# EAGLE board barbi_pozoriste_master_revb (EAGLE 5.00)
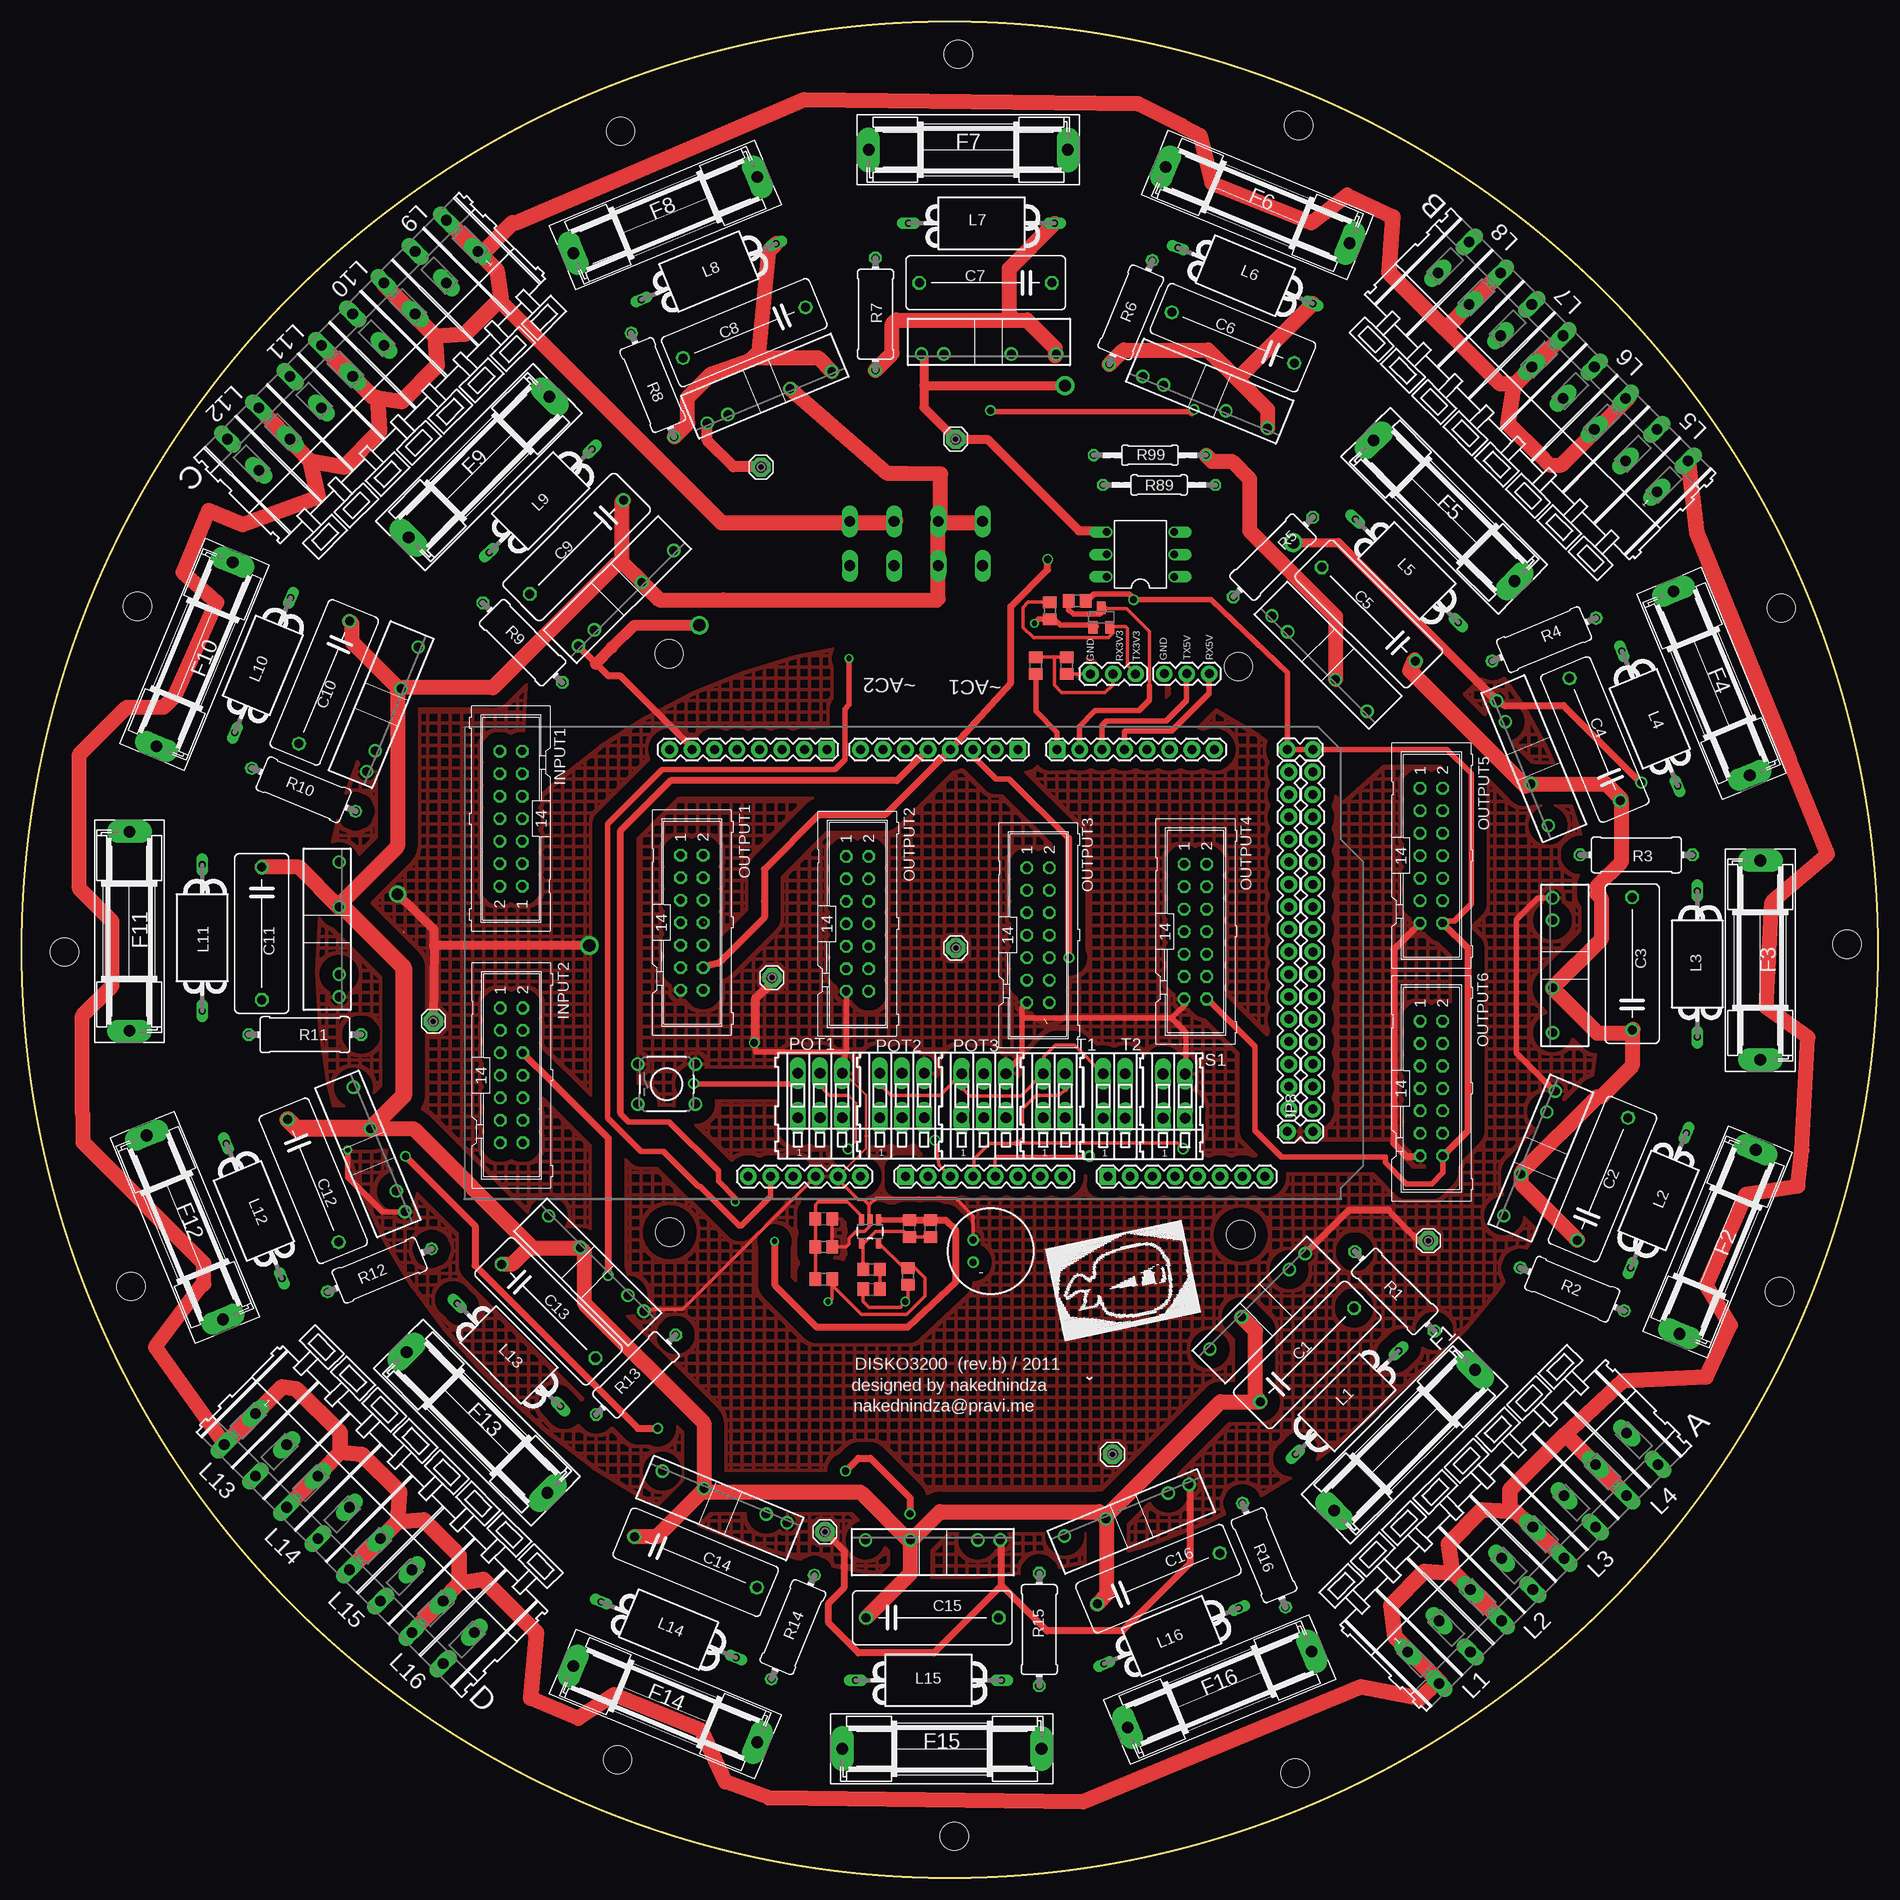
[diagram p2: board, top side]
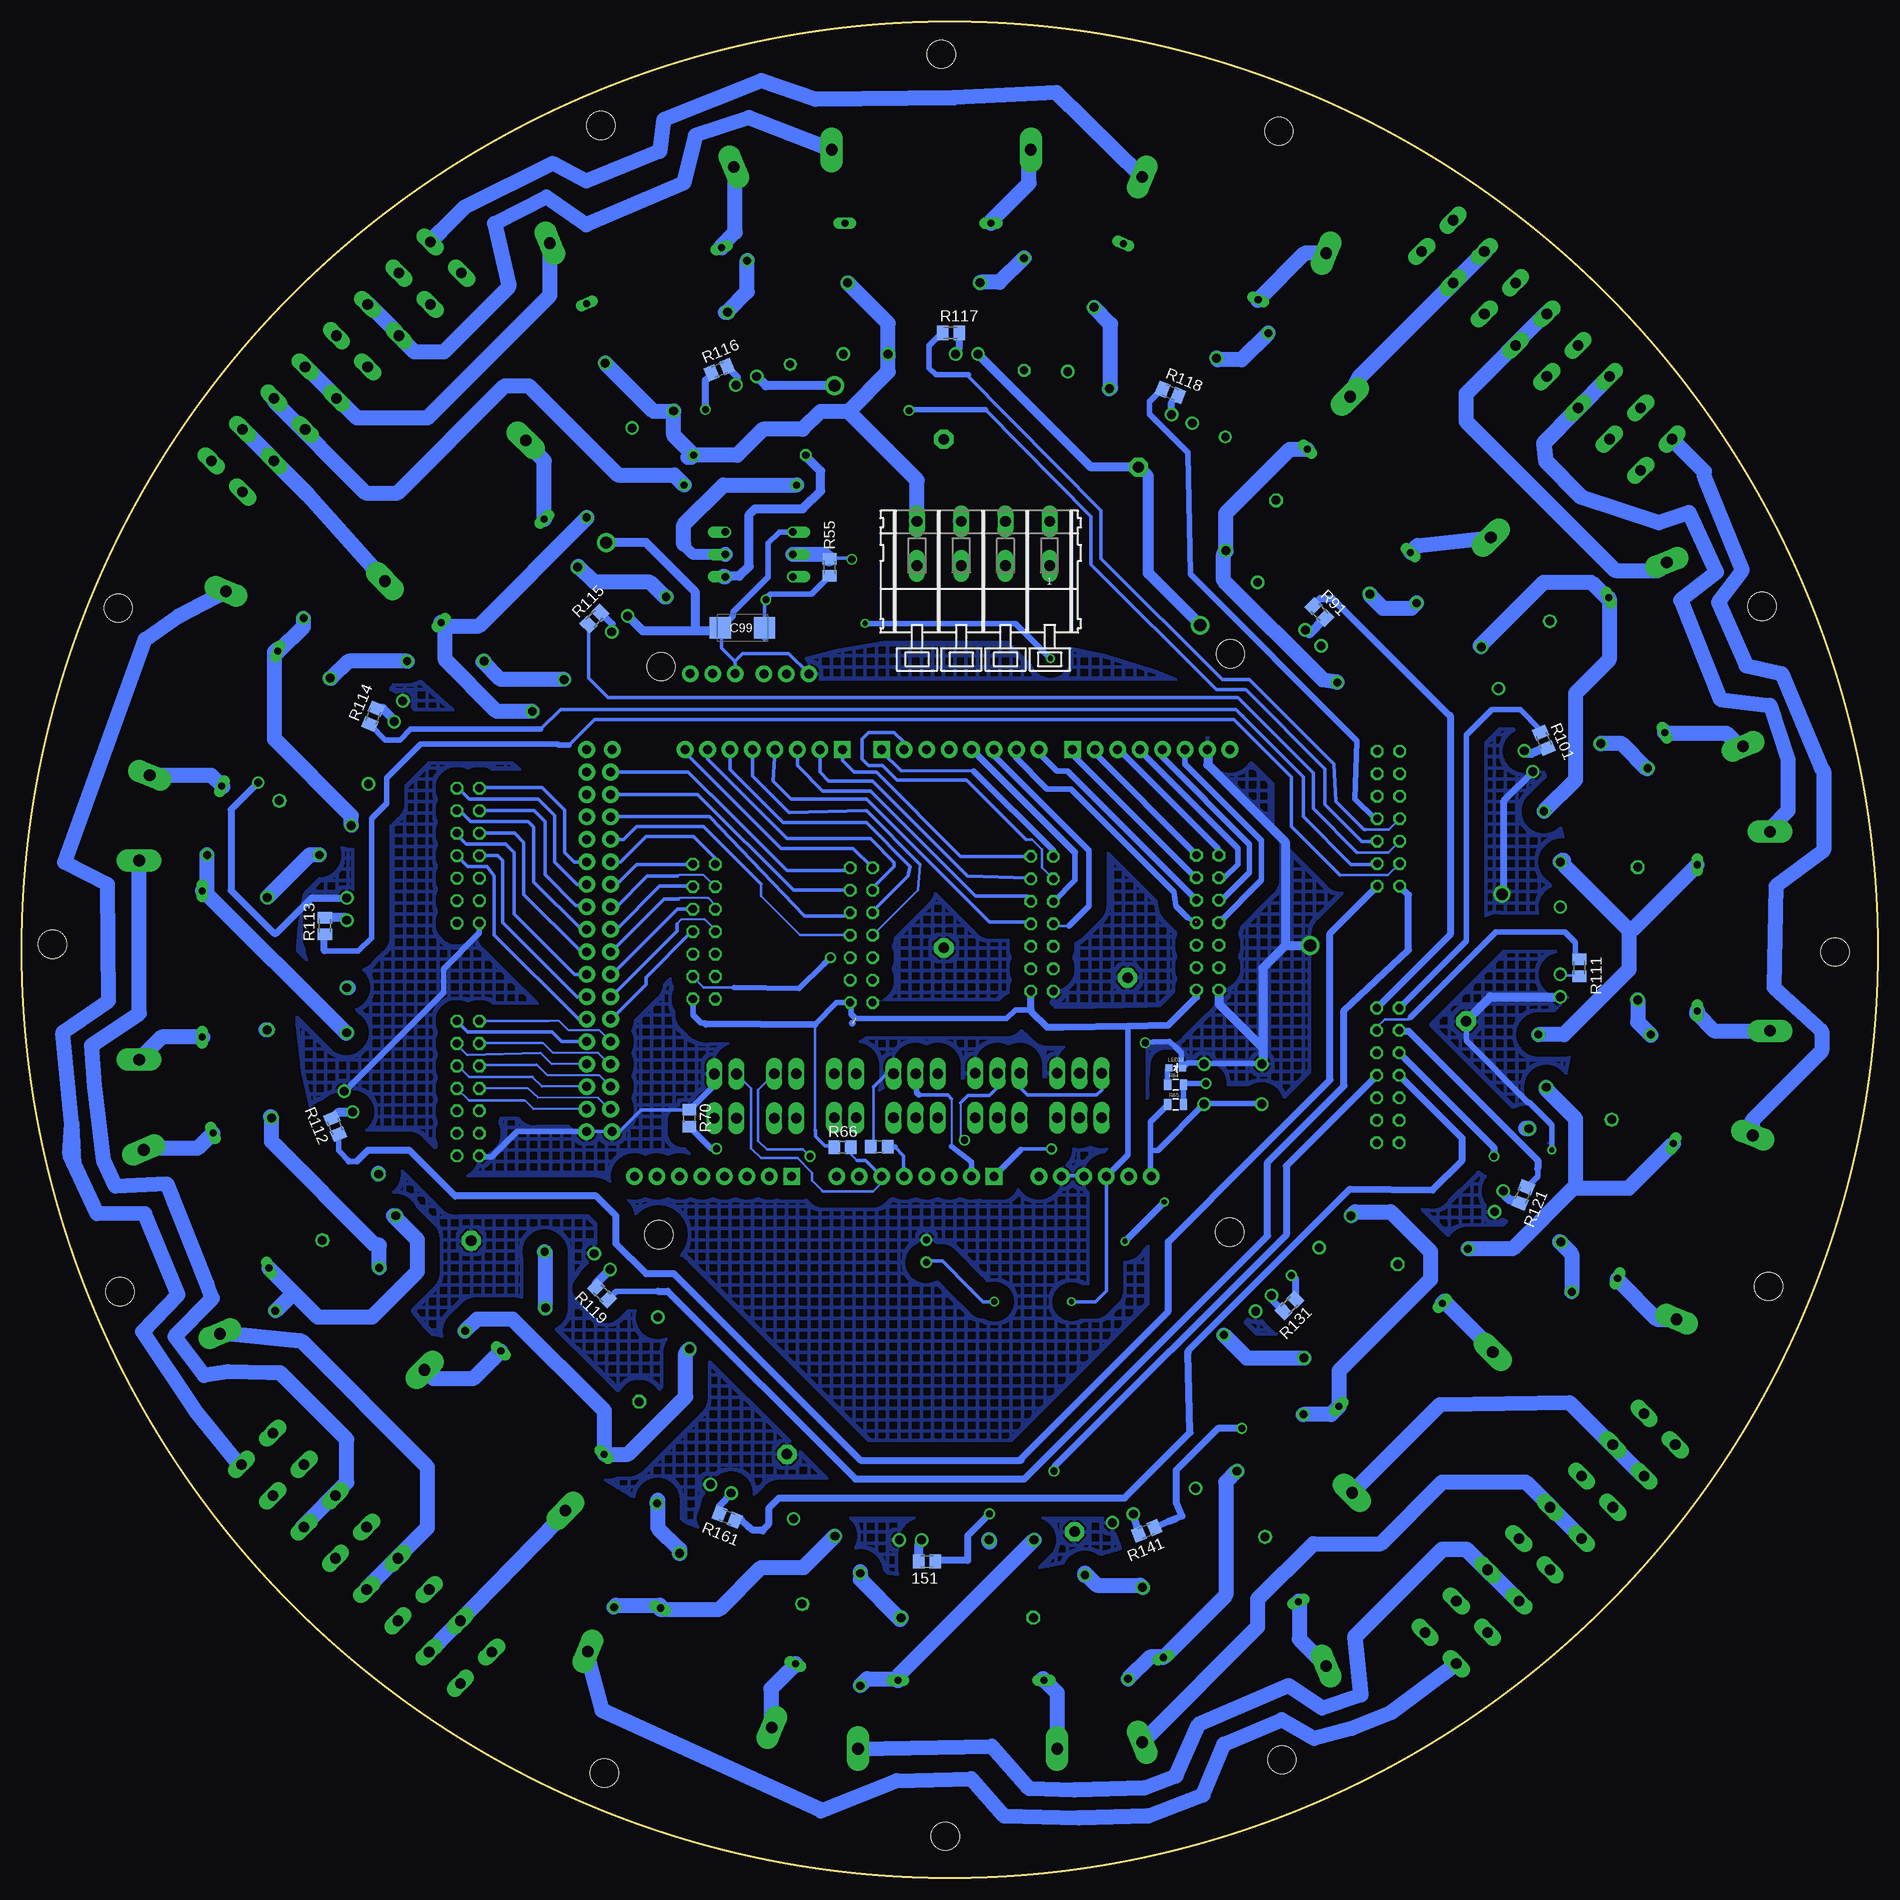
[diagram p3: board, bottom side, seen from below]

No outline drawn. Coordinates in mm, seen from the top.
Copper layers (1*16): Top 0.035mm / dielectric 1.5mm / Bottom 0.035mm
Design rules "default *": minimum track width 10mil, minimum drill 24mil, track to track 0.15mm, track to pad 0.15mm, pad to pad 0.15mm, via to via 0.15mm, smd to smd 0.15mm, copper to edge 40mil, drill to drill 8mil, minimum pad ring 10mil, minimum via ring 8mil, stop-mask expansion 4mil, vias tented up to drill 0mil, thermal gap 10mil
Holes 3.2 mm at -32.4,33.23 32.21,-32.42 -32.33,-32.15 31.94,31.79 -37.88,92.31 38.37,-93.28 -93.23,-38.28 -38.24,-91.8 38.76,92.95 93.31,38.39 -92.5,38.6 93.12,-38.88 0.27,101 -100.74,-0.47 -0.17,-100.44 100.73,0.41
Milling: area -105.5,-105.1 to 104.2,104.6

## Footprints (pad centres in the part's own frame; a part is rotated, then mirrored left to right if it is on the bottom)
M0805 = smd 1.3 x 1.6: 1 -0.95,0; 2 0.95,0
C150-064X183 = drill 1.016 octagon: 1 -7.493,0; 2 7.493,0
C0805 = smd 1.3 x 1.5: 1 -0.95,0; 2 0.95,0
SMC_C = smd 2.4 x 2.4: + -2.5,0; - 2.5,0
SH22,5 = drill 1.321 pad 2.54 long: 1 -11.252,0; 2 11.252,0
1X03 = drill 1.016 pad 1.88: 1 0,0; 2 2.54,0; 3 5.08,0
1X08 = drill 1.016 pad 1.88 square: 1 0,0 | drill 1.016 pad 1.88: 2 2.54,0; 3 5.08,0; 4 7.62,0; 5 10.16,0; 6 12.7,0; 7 15.24,0; 8 17.78,0
1X16 = drill 1.016 pad 1.88: 1 0,0; 2 2.54,0; 3 5.08,0; 4 7.62,0; 5 10.16,0; 6 12.7,0; 7 15.24,0; 8 17.78,0; 9 20.32,0; 10 22.86,0; 11 25.4,0; 12 27.94,0; 13 30.48,0; 14 33.02,0; 15 35.56,0; 16 38.1,0
1X06 = drill 1.016 pad 1.88: 1 0,0; 2 2.54,0; 3 5.08,0; 4 7.62,0; 5 10.16,0; 6 12.7,0
1X02_LOCK = drill 1.016 pad 1.88: 1 -0.178,0; 2 2.718,0
S102S01 = drill 1: 1 -7.62,0; 2 -2.54,0; 3 5.08,0; 4 7.62,0
ZD6-2W5 = drill 0.8 long: 1 -8.255,0; 2 8.255,0
LED-0603 = smd 0.8 x 0.8: A 0,-0.75; C 0,0.75
MCS08 = drill 1.194 pad 2.159 octagon: MP 0,0
DIL06 = drill 0.813 offset: 1 -2.54,-3.81; 2 0,-3.81; 3 2.54,-3.81; 4 2.54,3.81; 5 0,3.81; 6 -2.54,3.81
SOT23 = smd 1 x 1.4: 1 -0.95,-1.1; 2 0.95,-1.1; 3 0,1.1
0411/12 = drill 0.914 octagon: 1 -6.35,0; 2 6.35,0
R0805 = smd 1.3 x 1.5: 1 -0.95,0; 2 0.95,0
0805 = smd 0.8 x 1.2: 1 -0.9,0; 2 0.9,0
0207/12 = drill 0.813 octagon: 1 -6.35,0; 2 6.35,0
TACTILE-PTH = drill 1.016: 1 -3.251,2.261; 2 3.251,2.261; 3 -3.251,-2.261; 4 3.251,-2.261
ML14 = drill 0.914 octagon: 1 -7.62,-1.27; 2 -7.62,1.27; 3 -5.08,-1.27; 4 -5.08,1.27; 5 -2.54,-1.27; 6 -2.54,1.27; 7 0,-1.27; 8 0,1.27; 9 2.54,-1.27; 10 2.54,1.27; 11 5.08,-1.27; 12 5.08,1.27; 13 7.62,-1.27; 14 7.62,1.27
MIC-9.7MM = drill 0.8: 1 -2,1.27; 2 -2,-1.27
SOT23-5 = smd 0.55 x 1.2: 1 -0.95,-1.3; 2 0,-1.3; 3 0.95,-1.3; 4 0.95,1.3; 5 -0.95,1.3
255-404-5 = drill 1.2 long: A1 -7.5,0; A2 -2.5,0; A3 2.5,0; A4 7.5,0; B1 -7.5,-5; B2 -2.5,-5; B3 2.5,-5; B4 7.5,-5
255-408-5 = drill 1.2 long: A1 -17.5,0; A2 -12.5,0; A3 -7.5,0; A4 -2.5,0; A5 2.5,0; A6 7.5,0; A7 12.5,0; A8 17.5,0; B1 -17.5,-5; B2 -12.5,-5; B3 -7.5,-5; B4 -2.5,-5; B5 2.5,-5; B6 7.5,-5; B7 12.5,-5; B8 17.5,-5
233-103 = drill 1.2 long: A1 -2.5,2.5; A2 0,2.5; A3 2.5,2.5; B1 -2.5,-2.5; B2 0,-2.5; B3 2.5,-2.5
233-102 = drill 1.2 long: A1 -1.25,2.5; A2 1.25,2.5; B1 -1.25,-2.5; B2 1.25,-2.5

## Placement (x,y rotation side)
151  330R  [M0805]  1.88,-69.37 180 bottom
C1  68nF  [C150-064X183]  39.73,-46.02 45 top
C2  68nF  [C150-064X183]  73.11,-26.14 67.5 top
C3  68nF  [C150-064X183]  76.46,-1.79 90 top
C4  68nF  [C150-064X183]  72.24,23.54 112.5 top
C5  68nF  [C150-064X183]  46.68,37.73 135 top
C6  68nF  [C150-064X183]  31.33,68.96 157.5 top
C7  68nF  [C150-064X183]  3.38,75.17 180 top
C8  68nF  [C150-064X183]  -23.91,69.53 202.5 top
C9  68nF  [C150-064X183]  -42.85,45.3 225 top
C10  68nF  [C150-064X183]  -71.38,30 247.5 top
C11  68nF  [C150-064X183]  -78.45,1.61 270 top
C12  68nF  [C150-064X183]  -72.62,-26.34 292.5 top
C13  68nF  [C150-064X183]  -46.03,-41.08 315 top
C14  68nF  [C150-064X183]  -29.4,-69.45 337.5 top
C15  68nF  [C150-064X183]  -2.64,-75.73 0 top
C16  68nF  [C150-064X183]  22.92,-71.3 22.5 top
C17  4.7uF  [C0805]  -9.52,-38.58 0 top
C18  12pF  [C0805]  -5.24,-31.75 90 top
C19  1uF  [C0805]  -14.92,-30.64 180 top
C99  47uF  [SMC_C]  22.74,36.17 180 bottom
F1  3A  [SH22,5]  50.73,-55.68 225 top
F2  3A  [SH22,5]  86.12,-33.24 247.5 top
F3  3A  [SH22,5]  90.94,-1.38 90 top
F4  3A  [SH22,5]  85.45,29.88 112.5 top
F5  3A  [SH22,5]  55.21,49.4 315 top
F6  3A  [SH22,5]  34.11,83.96 337.5 top
F7  3A  [SH22,5]  1.42,90.2 0 top
F8  3A  [SH22,5]  -32.84,82.81 22.5 top
F9  3A  [SH22,5]  -53.89,54.33 45 top
F10  3A  [SH22,5]  -86.03,33.17 67.5 top
F11  3A  [SH22,5]  -93.42,1.87 90 top
F12  3A  [SH22,5]  -87.15,-31.6 112.5 top
F13  3A  [SH22,5]  -54.11,-53.65 315 top
F14  3A  [SH22,5]  -32.83,-85.5 337.5 top
F15  3A  [SH22,5]  -1.57,-90.53 0 top
F16  3A  [SH22,5]  29.84,-83.84 22.5 top
JP1  [1X03]  23.57,30.97 0 top
JP2  [1X03]  15.24,30.96 0 top
JP3  [1X08]  -14.57,22.41 180 top
JP4  [1X08]  7.02,22.41 180 top
JP5  [1X08]  11.46,22.41 0 top
JP6  [1X08]  17.18,-25.85 0 top
JP7  [1X08]  -5.68,-25.85 0 top
JP8  M16PTH  [1X16]  40.36,-18.23 90 top
JP9  M16PTH  [1X16]  37.66,-18.23 90 top
JP10  [1X06]  -23.46,-25.85 0 top
JP11  [1X02_LOCK]  37.67,-20.77 0 top
JP12  [1X02_LOCK]  37.65,22.41 0 top
K1  S202S01  [S102S01]  34.12,-39.96 45 top
K2  S202S01  [S102S01]  64.87,-23.25 67.5 top
K3  S202S01  [S102S01]  67.48,-1.98 90 top
K4  S202S01  [S102S01]  64.06,20.87 112.5 top
K5  S202S01  [S102S01]  41.12,32.11 135 top
K6  S202S01  [S102S01]  28.19,61.66 157.5 top
K7  S202S01  [S102S01]  3.74,67.11 180 top
K8  S202S01  [S102S01]  -21.06,62.22 202.5 top
K9  S202S01  [S102S01]  -37.27,39.52 225 top
K10  S202S01  [S102S01]  -63.68,26.96 247.5 top
K11  S202S01  [S102S01]  -69.69,2.08 270 top
K12  S202S01  [S102S01]  -65.18,-22.79 292.5 top
K13  S202S01  [S102S01]  -40.64,-35.69 315 top
K14  S202S01  [S102S01]  -26.12,-62.07 337.5 top
K15  S202S01  [S102S01]  -2.58,-66.94 0 top
K16  S202S01  [S102S01]  19.33,-63.58 22.5 top
L1  300uH  [ZD6-2W5]  44.22,-51.41 45 top
L2  300uH  [ZD6-2W5]  79.44,-28.56 67.5 top
L3  300uH  [ZD6-2W5]  83.81,-1.83 270 top
L4  300uH  [ZD6-2W5]  78.45,25.89 292.5 top
L5  300uH  [ZD6-2W5]  50.99,42.6 135 top
L6  300uH  [ZD6-2W5]  32.73,75.97 157.5 top
L7  300uH  [ZD6-2W5]  2.91,81.89 180 top
L8  300uH  [ZD6-2W5]  -27.92,76.44 202.5 top
L9  300uH  [ZD6-2W5]  -46.93,50.52 225 top
L10  300uH  [ZD6-2W5]  -78.33,31.94 247.5 top
L11  300uH  [ZD6-2W5]  -85.17,1.12 270 top
L12  300uH  [ZD6-2W5]  -79.33,-29.75 292.5 top
L13  300uH  [ZD6-2W5]  -50.52,-46.02 135 top
L14  300uH  [ZD6-2W5]  -32.45,-77.07 157.5 top
L15  300uH  [ZD6-2W5]  -3.07,-82.8 180 top
L16  300uH  [ZD6-2W5]  24.39,-77.79 202.5 top
LED33  Red  [LED-0603]  -26.21,-13.58 270 bottom
LSP1  MCS08  [MCS08]  -20.79,-3.38 315 top
LSP2  MCS08  [MCS08]  -14.8,-66 315 top
LSP3  MCS08  [MCS08]  53.43,-33.11 315 top
LSP4  MCS08  [MCS08]  0,-0.01 315 top
LSP5  MCS08  [MCS08]  -0.01,57.48 315 top
LSP6  MCS08  [MCS08]  -22.01,54.33 315 top
LSP7  MCS08  [MCS08]  -59.05,-8.3 315 top
LSP8  MCS08  [MCS08]  17.73,-57.25 315 top
OK1  H11A1M  [DIL06]  20.87,44.47 90 top
Q1  BSS123  [SOT23]  16.45,37.34 0 top
R1  120R 2W  [0411/12]  49.61,-38.84 135 top
R2  120R 2W  [0411/12]  69.68,-38.6 337.5 top
R3  120R 2W  [0411/12]  76.92,10.5 0 top
R4  120R 2W  [0411/12]  66.5,34.84 22.5 top
R5  120R 2W  [0411/12]  35.86,44.16 45 top
R6  120R 2W  [0411/12]  19.79,71.82 247.5 top
R7  120R 2W  [0411/12]  -9.08,71.62 270 top
R8  120R 2W  [0411/12]  -34.25,63.61 292.5 top
R9  120R 2W  [0411/12]  -48.96,34.49 135 top
R10  120R 2W  [0411/12]  -73.71,17.86 337.5 top
R11  120R 2W  [0411/12]  -73.57,-9.82 0 top
R12  120R 2W  [0411/12]  -65.13,-36.46 22.5 top
R13  120R 2W  [0411/12]  -36.15,-48.27 225 top
R14  120R 2W  [0411/12]  -18.41,-76.78 247.5 top
R15  120R 2W  [0411/12]  9.44,-77.06 270 top
R16  120R 2W  [0411/12]  34.84,-68.66 292.5 top
R17  2k2  [R0805]  -5.4,-37.15 90 top
R18  10k  [R0805]  9.05,31.91 90 top
R19  10k  [R0805]  12.54,31.91 270 top
R20  10k  [R0805]  -9.53,-36.35 0 top
R21  10k  [R0805]  -14.92,-37.46 0 top
R22  10k  [R0805]  -14.92,-33.81 180 top
R23  1M  [R0805]  -2.86,-31.75 270 top
R24  10k  [R0805]  10.64,38.1 90 top
R25  10k  [R0805]  13.72,39.21 180 top
R55  10k  [M0805]  12.92,43.01 270 bottom
R64  330  [0805]  -26.21,-15.49 0 bottom
R65  10k  [0805]  -26.21,-17.71 0 bottom
R66  1k  [R0805]  11.44,-22.53 0 bottom
R70  10k  [R0805]  28.76,-19.28 270 bottom
R71  10k  [R0805]  7.28,-22.49 0 bottom
R89  47k 1W  [0207/12]  22.99,52.31 0 top
R91  330R  [M0805]  -42.44,37.94 315 bottom
R99  47k 1W  [0207/12]  21.94,55.68 0 top
R101  330R  [M0805]  -67.82,23.44 292.5 bottom
R111  330R  [M0805]  -71.85,-2.24 270 bottom
R112  330R  [M0805]  68.78,-20.18 112.5 bottom
R113  330R  [M0805]  69.95,2.47 90 bottom
R114  330R  [M0805]  64.5,26.17 67.5 bottom
R115  330R  [M0805]  39.49,37.19 45 bottom
R116  330R  [M0805]  25.36,65.33 22.5 bottom
R117  330R  [M0805]  -0.81,69.51 0 bottom
R118  330R  [M0805]  -25.61,62.78 337.5 bottom
R119  330R  [M0805]  38.61,-39.06 135 bottom
R121  330R  [M0805]  -65.49,-27.94 247.5 bottom
R131  330R  [M0805]  -39.07,-40.41 225 bottom
R141  330R  [M0805]  -22.92,-65.92 202.5 bottom
R161  330R  [M0805]  24.48,-64.35 157.5 bottom
S1  [TACTILE-PTH]  -32.69,-15.41 0 top
SV1  [ML14]  -50.28,14.6 90 top
SV2  [ML14]  -29.83,2.84 270 top
SV3  [ML14]  -11.11,2.7 270 top
SV4  [ML14]  9.32,1.43 270 top
SV5  [ML14]  27.09,1.83 270 top
SV6  [ML14]  53.77,-15.9 270 top
SV7  [ML14]  53.76,10.41 270 top
SV8  [ML14]  -50.22,-14.42 270 top
U$1  MIC9.7MM  [MIC-9.7MM]  3.97,-34.29 0 top
U$2  OPA344  [SOT23-5]  -9.68,-32.07 180 top
X1  WAGO4-255-404-5  [255-404-5]  -4.48,43.19 180 bottom
X2  WAGO8-255-408-5  [255-408-5]  -66.4,66.33 225 top
X3  WAGO8-255-408-5  [255-408-5]  -66.78,-65.01 315 top
X5  WAGO8-255-408-5  [255-408-5]  63.47,-67.24 45 top
X6  WAGO8-255-408-5  [255-408-5]  66.88,63.89 135 top
X10  [233-103]  -15.35,-16.69 0 top
X11  [233-103]  3.17,-16.72 0 top
X12  [233-103]  -6.08,-16.7 0 top
X13  [233-102]  11.14,-16.72 0 top
X14  [233-102]  17.91,-16.75 0 top
X15  [233-102]  24.67,-16.76 0 top

## Tracks (layer width: path | path; a pad name or v marks a point on that pad's centre or on a via)
3.3  (via drill 0.6)
  Top 0.61: v8.89,36.67 9.37,37.15 10.48,37.15 11.11,37.15 11.81,36.45 15.62,36.45 15.83,36.24 Q1.1 15.88,36.32 | v-12.06,32.7 -12.06,27.46 -12.54,26.99 -12.54,21.27 -13.65,20.16 -33.18,20.16 -39.37,13.97 -39.37,-19.21 -35.56,-23.02 -33.02,-23.02 -29.05,-26.99 -28.89,-26.99 -24.45,-31.43 -24.29,-31.43 -20.95,-28.1 -20.95,-26.04 -20.92,-26 JP10.2
  Top 0.813: 10.48,37.15 R24.1
  Bottom 0.61: v8.89,36.67 -8.1,36.67 v-12.06,32.7
5V  (via drill 0.8 pad 1.27)
  Top 0.406: X11.A1 -1.8,-16.69 -7.33,-16.69 -8.58,-15.44 | 0.7,-15.83 1.59,-16.72 7.39,-16.72 X13.A1 9.96,-14.15 9.96,-12.31 11.28,-10.99 13.41,-10.99 X14.A1
  Top 0.61: X12.A1 -8.58,-15.44 | X11.A1 0.7,-14.25 0.7,-15.83 | v-29.63,-15.34 -29.57,-15.41 -17.97,-15.41 -17.77,-15.21 -17.77,-14.12 | -17.77,-14.12 -17.77,-14.09 | X10.A1 -17.77,-14.12
  Bottom 0.406: R65.2 -27.17,-17.71 | R64.2 -27.17,-15.54 | -17.86,-14.21 -17.86,-16.09 -17.28,-16.66 -9.49,-16.66 -8.45,-15.62
  Bottom 0.61: -27.17,-15.54 -27.37,-15.34 | -27.07,-15.34 -27.07,-15.45 R64.2 -27.08,-15.45 | R65.2 -27.07,-17.67 -27.08,-17.67 -27.08,-15.45 | -17.86,-14.21 X10.A1 | X12.A1 -8.45,-14.19 -8.45,-15.62 | -27.08,-15.45 -27.19,-15.34 v-29.63,-15.34
A0  (via drill 0.8 pad 1.27)
  Top 0.305: v-12.18,-22.75 -11.24,-21.81 -11.24,-17.56 -12.11,-16.69
  Top 0.406: -12.11,-16.69 -14.26,-16.69 -15.38,-15.57 -15.38,-14.2 X10.A2
  Bottom 0.406: JP7.1 -5.62,-25.92 | -8.74,-22.79 -8.79,-22.75 v-12.18,-22.75
  Bottom 0.61: -8.74,-22.79 JP7.1
A1
  Bottom 0.254: -0.89,-17.06 -0.89,-22.47
  Bottom 0.406: 2.78,-16.66 -0.45,-16.63 -0.89,-17.06
  Bottom 0.61: X11.A2 3.08,-14.31 3.08,-16.36 2.78,-16.66 | JP7.2 -3.15,-24.23 -0.89,-22.47
A2  (via drill 0.8 pad 1.02)
  Top 0.406: JP7.3 -1.89,-24.57 v-2.34,-21.75
  Bottom 0.254: v-2.34,-21.75 -1.89,-21.3 -1.89,-17.57
  Bottom 0.406: -1.89,-17.57 -2.77,-16.69 -5.18,-16.69 -6.14,-15.73 -6.14,-14.14 X12.A2
  Bottom 0.61: -6.01,-14.19 -6.07,-14.19 X12.A2
A3  (via drill 0.8 pad 1.27)
  Top 0.305: 7.62,-18.17 7.62,-21.38 6.93,-22.06 | 25.03,-22.04 v25.7,-22.71
  Top 0.406: 12.38,-16.02 11.69,-16.71 9.09,-16.71 7.62,-18.17 | 6.87,-22.13 3.8,-22.13 2.09,-23.84 2.09,-25.81 | 6.91,-22.04 25.03,-22.04
  Top 0.61: X13.A2 12.38,-14.23 12.38,-16.02 | 6.87,-22.13 6.93,-22.06 6.91,-22.04 | 2.09,-25.81 1.98,-25.81 JP7.4
  Bottom 0.61: R70.2 26.28,-22.71 v25.7,-22.71
A4  (via drill 0.8 pad 1.27)
  Top 0.305: v15.12,-23.57 | 4.44,-25.83 4.46,-25.83 JP7.5 | 4.7,-23.57 4.44,-23.82
  Top 0.406: v15.12,-23.57 4.7,-23.57 | 4.44,-23.82 4.44,-25.83
  Bottom 0.305: X14.A2 21,-16.09 21,-21.81 19.99,-22.82 15.92,-22.82 15.17,-23.57 v15.12,-23.57
  Bottom 0.406: 4.54,-25.8 4.54,-23.5 5.52,-22.52
  Bottom 0.61: JP7.5 4.54,-25.8 | 6.36,-22.52 6.39,-22.52 | 6.36,-22.52 R71.2 | 5.52,-22.52 6.36,-22.52
A5
  Bottom 0.305: X15.A1 21.77,-15.92 21.77,-22.67 20.66,-23.78 16.55,-23.78 14.89,-25.44 14.89,-26.31 13.77,-27.44 13.77,-27.45 13.7,-27.52 8,-27.52 6.87,-26.43 | 10.45,-22.49 10.45,-22.44 | 10.45,-22.49 R66.2 | 9.79,-24.05 10.45,-23.39 10.45,-22.49
  Bottom 0.406: JP7.6 8.82,-24.05 9.79,-24.05
  Bottom 0.61: JP7.6 7,-25.87 6.87,-25.87 6.87,-26.43
AC_NEUTRAL
  Top 1.676: -51.42,73.42 -51.42,72.97 -26.5,48.05 -11.95,48.05 | -11.95,48.05 -11.95,48.16 X1.B1 | X1.B2 -7.12,48.05 -11.95,48.05 | 63.08,63.54 62.86,63.76 61.51,63.76 55.34,69.94 55.34,70.16 55.22,70.05 | 84.86,-48.49 87.55,-42.65 84.86,-38.16 89.35,-27.84 95.19,-26.94 95.64,-22.9 96.31,-10.1 91.59,-6.73 92.27,5.17 98.55,10.55 94.29,21.11 | 20.58,95.39 25.59,92.95 27.61,91.83 28.96,86.44 40.18,81.95 44.22,85.09 49.39,82.62 | -84.42,49.39 -87.34,42.43 -83.52,39.07 -88.24,28.52 -89.54,27.21 -93.71,27.21 -99.07,21.85 -99.07,6.7 -95.35,2.98 -95.35,-4.3 -98.71,-7.66 -98.71,-18.81 -98.64,-18.88 -98.64,-22.02 -85,-35.67 -85,-38.04 -85.32,-38.16 -90.48,-45.12 -82.62,-56.12 | -48.05,-84.86 -42.66,-87.11 -38.62,-84.41 -28.74,-88.45 -26.05,-94.29 -21.11,-96.09 | 66,55.68 67.12,54.56 68.47,54.56 76.1,62.19 75.79,62.19 X6.B3
  Top 1.778: -84.42,49.39 -80.6,47.82 -72.07,50.97 -72.97,55.01 | -53.66,78.35 -51.87,76.56 -51.42,73.42 -55.46,69.38 -58.83,69.15 | -53.66,78.35 X2.B1 | X2.B3 -64.66,74.99 -58.83,69.15 | X2.B5 -65.78,62.19 -65.34,62.13 | -65.34,62.13 -62.64,61.74 -58.6,65.78 -58.83,69.15 | -72.97,55.01 X2.B7 | -72.97,55.01 -69.15,54.33 -65.11,58.37 -65.34,62.19 -65.34,62.13 | -82.85,-55.9 X3.B1 -82.62,-56.12 -76.11,-49.61 -74.54,-49.84 -69.6,-54.78 -69.6,-57.02 | -69.6,-57.02 X3.B3 | -63.09,-64.88 X3.B5 | -63.09,-64.88 -62.87,-61.51 -67.13,-57.25 -69.6,-57.02 | -56.13,-71.84 X3.B7 | -56.13,-71.84 -56.13,-68.7 -60.17,-64.66 -63.09,-64.88 | -56.13,-71.84 -53.44,-71.39 -47.38,-77.45 -48.05,-84.86 | -21.11,-96.09 14.36,-96.53 45.79,-83.51 52.53,-84.86 54.33,-83.06 X5.B1 54.77,-83.06 49.61,-77.9 49.16,-74.31 52.98,-70.49 56.11,-70.7 | X5.B3 56.35,-70.72 56.11,-70.7 | X5.B5 63.31,-63.76 62.62,-63.72 | 62.62,-63.72 59.49,-63.53 55.67,-67.35 56.12,-70.49 56.11,-70.7 | X5.B7 70.49,-56.57 68.92,-55 | 68.92,-55 62.63,-61.29 62.63,-63.53 62.62,-63.72 | X6.B5 63.08,63.54 62.41,59.27 66,55.68 | X1.B2 -6.78,48.27 | X1.B1 -12.17,47.82 | X6.B1 83.74,46.92 94.29,21.11 | 84.86,-48.49 75.43,-48.94 68.92,-55 | X6.B7 55.34,69.94 55.22,70.05 48.94,76.33 49.39,82.62 | 20.58,95.39 -17.14,95.84 -49.62,81.95 -50.07,81.95 -53.66,78.35
  Bottom 1.676: R89.2 30.46,53.44 36.81,53.44 46.92,63.54 49.61,63.54 61.73,51.41 65.33,51.41 75.65,61.74 75.65,62.19 | 75.65,62.19 | X6.B3 75.65,62.19
AC_PHASE
  Top 1.676: K5.2 42.91,37.46 33.22,47.15 33.22,52.99 31.2,55.01 28.96,55.01 R99.2 | R99.2 | R99.2 | K16.2 16.99,-64.28 29.94,-51.32 C1.1 33.9,-50.78 33.9,-43.33 K1.2 | -48.05,-33.67 -47.83,-33.9 K13.2 -41.99,-34.35 -41.99,-40.18 -28.46,-53.71 K14.2 -28.46,-61.24 | -48.05,-33.67 -61.3,-20.43 -65.78,-20.43 -66.01,-20.2 -66.16,-20.35 K12.2 | C14.1 -33.81,-66.58 -28.46,-61.24 | C13.1 -50.16,-35.78 -48.05,-33.67 | 51.31,31.31 51.86,32.56 | C5.1 51.31,31.31 | 51.31,31.31 64.36,18.26 K4.2 73.53,18.52 75.2,16.84 75.11,16.74 C4.1 75.2,16.52 75.2,9.66 72.51,6.96 72.51,6.06 72.96,5.62 72.96,0.96 K3.2 67.48,-4.62 72.51,-9.65 76.1,-9.65 C3.1 | C3.1 76.55,-9.2 | C3.1 76.46,-13.34 72.96,-16.84 72.51,-16.84 63.89,-25.45 K2.2 63.89,-26.63 70.27,-33 70.24,-33.02 C2.1 | -28.46,-61.24 -28.19,-61.51 -10.78,-61.51 -5.17,-67.12 | -5.17,-67.12 -5.17,-66.98 K15.2 -5.17,-66.89 -5.17,-66.68 -4.72,-66.68 -1.8,-63.76 16.19,-63.76 K16.2 | C15.1 -5.17,-70.77 -5.17,-67.12 | K16.2 17.06,-64.63 17.06,-73.11 C16.1 | C10.1 -68.25,36.66 -68.25,34.58 -62.87,29.19 | -62.87,29.19 -62.82,29.19 K10.2 -62.6,29.41 -52.31,29.41 -38.4,43.33 -37.5,43.33 | -62.87,29.19 -63.09,28.96 -63.09,11.45 -69.6,4.94 -69.6,4.52 | -69.6,4.52 -69.6,4.49 | -69.6,4.52 K11.2 -69.73,4.62 -74.22,9.11 C11.1 | C9.1 -37.72,50.42 -37.72,43.56 -37.5,43.33 | -37.5,43.33 K9.2 -35.57,41.4 | K8.2 -7.7,53.61 -5.58,53.61 -1.7,53.55 -1.7,48.3 -1.91,48.1 -1.98,48.17 X1.B3 | X1.B3 -1.77,48.41 -1.7,48.41 -1.34,48.04 3.07,48.04 3.07,48.15 X1.B4 | X1.B3 -2,48.17 -2,39.45 -2.15,39.3 -26.25,39.3 -26.27,39.31 -33.46,39.31 -35.55,41.4 -35.57,41.4 | -35.57,41.4 -35.62,41.4
  Top 1.778: K11.2 -69.38,4.72
  Top 1.93: K11.2 -69.59,4.72 -69.38,4.72 -62.42,-2.24 -62.42,-16.71 K12.2 -66.17,-20.43 -74.48,-20.43 C12.1
  Bottom 1.676: C3.1 76.64,-9.29 | K3.2 67.32,-4.52 | 10.77,60.62 13.91,60.62 15.94,58.6 20.43,58.6 23.34,55.68 R99.2 | R99.2 28.51,55.45 28.96,55.45 | R99.2 | R99.2 | K7.2 6.28,66.91 | -1.84,48.27 -1.92,48.19 X1.B3 | C5.1 52.08,32.33 50.07,30.32 K5.2 | R99.2 | R99.2 30.53,57.93 K6.2 30.53,60.62 32.78,60.62 C6.1 | K2.2 63.89,-25.45 | C7.1 6.28,70.58 K7.2 | 10.77,60.62 6.28,65.11 K7.2 | K8.2 -18.83,63.31 -18.86,63.31 -18.86,70.52 C8.1 | X1.B4 3,48.22 3,52.84 10.77,60.62
  Bottom 1.778: K12.2 -65.78,-20.43 | K15.2 -5.17,-67.12 | X1.B4 3.1,48.27 | X1.B4 | X1.B4
D2  (via drill 0.8)
  Top 0.61: 2.02,22.45 1.99,22.45 JP4.3 1.96,22.43 | 12.79,12.35 6.04,19.1 4.54,19.1 1.96,21.68 1.96,22.43 | 1.96,22.43 1.96,22.61
  Top 0.813: v12.79,-1.12 12.79,12.35
  Bottom 0.305: SV5.12 27.17,-4.52 23.73,-4.51
  Bottom 0.61: 23.73,-4.51 16.33,-4.61 13.58,-1.91 v12.79,-1.12
D3  (via drill 0.8)
  Top 0.406: -28.55,-2.18 -28.55,-2.23 SV2.12 | -21.62,5.28
  Top 0.813: -28.55,-2.18 -26.78,-1.73 -21.62,3.42 -21.62,5.28 -21.62,8.87 -15.43,15.06 -7.95,15.06 JP4.4 6.23,29.95 6.23,38.57 10.39,42.72 v10.39,43.91
  Bottom 0.406: 12.98,44.02 13.04,44.02 | 12.98,44.02 R55.1 | v10.39,43.91 10.51,44.02 12.98,44.02
  Bottom 1.676: R55.1 12.97,43.96 13.48,44.47 OK1.5
D4  (via drill 0.6)
  Top 0.406: -5.4,-30.8 -5.39,-30.8 C18.2 -5.08,-30.8 -5.11,-30.77 | -3.02,22.54 JP4.5
  Top 0.61: v-24.92,-28.73 -24.92,-28.26 -26.83,-26.35 -26.83,-25.24 -32.38,-19.68 -36.99,-19.68 -37.94,-18.73 -37.94,-18.57 | -5.11,-30.77 U$2.1
  Top 0.813: v-20.48,-33.18 -20.48,-38.1 -15.72,-42.86 -5.4,-42.86 0,-37.78 0,-31.91 -1.11,-30.8 R23.1 -5.08,-30.8 | -37.94,-18.57 -37.94,13.18 -32.23,18.89 -6.67,18.89 JP4.5 | -5.08,-30.8 -5.11,-30.77 | -5.08,-30.8 C18.2
  Bottom 0.406: -3.19,22.41 JP4.5 | -12.35,5.17 -12.38,5.2 SV3.5
  Bottom 0.61: -14.82,10.78 -14.82,7.63 -12.38,5.2
  Bottom 0.813: -14.82,10.78 -3.19,22.41 | v-24.92,-28.73 v-20.48,-33.18
D5
  Bottom 0.305: -12.38,2.89 -12.35,2.92 | -12.38,2.89 SV3.7 | -14.15,2.47 -12.8,2.47 -12.38,2.89
  Bottom 0.406: -5.68,21.71 JP4.6
  Bottom 0.61: -5.68,21.71 -16.39,11 -16.39,4.72 -14.15,2.47
D6  (1 unrouted)
  Bottom 0.305: -28.44,2.84 -28.29,2.7
  Bottom 0.61: JP4.7 -8.18,22.45 -8.09,22.45 -8.09,21.55 -11.68,17.96 -14.37,17.96 -26.05,6.29 -26.27,4.72 -27.62,3.37 -28.52,2.92 -28.52,2.89 SV2.8
D7
  Bottom 0.61: SV2.6 -13.96,19.98 -12.8,19.98 -11.01,21.78 -11.01,22.23 -10.94,22.23 JP4.8
D8
  Bottom 0.406: -28.41,7.97 -28.51,7.97 SV2.4
  Bottom 0.61: JP3.1 -14.82,22.16 -14.82,21.55 -28.29,8.08 -28.72,8.08 | -28.72,8.08 -28.74,8.08 | -28.72,8.08 SV2.4
D9
  Bottom 0.305: -28.56,10.51 SV2.2
  Bottom 0.61: -16.84,22.23 -28.56,10.51
  Bottom 0.813: JP3.2 -17.07,22.45 -16.84,22.23
D10
  Bottom 0.305: JP3.3 -19.81,22.41
  Bottom 0.406: -31.12,10.46 SV2.1 -30.99,10.35 | -30.99,10.35 -30.99,10.33 | -30.99,11.23 -30.99,10.35
  Bottom 0.61: -31.12,10.46 -31.21,10.55 | -19.81,22.41 -30.99,11.23
D11
  Bottom 0.305: JP3.4 -22.19,22.27
  Bottom 0.406: SV2.3 -31.15,7.92 -31.21,7.86 -31.66,7.86
  Bottom 0.61: -22.19,22.27 -33.23,11.23 -33.23,9.43 -31.66,7.86
D12
  Bottom 0.305: JP3.5 -24.73,22.42 -24.7,22.45 -24.7,21.55
  Bottom 0.406: -31.43,5.38 SV2.5
  Bottom 0.61: -24.7,21.55 -34.58,11.68 -34.58,8.53 -31.43,5.38
D13
  Bottom 0.305: -31.1,2.81 -30.99,2.7 | -31.1,2.81 SV2.7 | -31.1,2.81 -31.21,2.92 -31.44,3.15
  Bottom 0.406: -31.21,2.92 -31.13,2.84 SV2.7
  Bottom 0.61: -31.21,2.92 -35.93,7.63 -35.93,12.13 -27.27,20.78 JP3.6 -27.17,22.51
D14
  Top 0.61: R18.1 9.05,26.73 11.45,24.33 11.45,22.6 11.48,22.58 11.46,22.56 JP5.1
  Top 0.813: JP5.1 11.43,22.38 | JP5.1 | JP5.1 11.59,22.54
  Bottom 0.406: JP5.1 11.46,21.15 10.16,19.84 7.62,19.84 -1.91,10.32 -9.68,10.32 -9.84,10.16 -9.85,10.16 SV3.2
D15
  Top 0.406: 21.91,29.65 21.9,35.75 21.9,35.76 19.3,38.35 16.89,38.35 16.81,38.44 | 16.81,38.44 16.76,38.48 | 16.81,38.44 Q1.3
  Top 0.61: 21.91,29.65 21.91,28 20.7,26.8 15.75,26.8 13.97,25.02 13.97,22.48 14,22.45 JP5.2 | R25.2 12.77,38.16 13.34,37.72 16.26,37.72 16.89,38.35 16.83,38.42 Q1.3
  Bottom 0.305: -9.85,7.67 -9.88,7.63 | SV3.4 -9.85,7.67 | -9.85,7.67 -9.66,7.86
  Bottom 0.406: JP5.2 14,19.85 13.02,18.86 8.08,18.86 -2.7,8.08 -9.66,7.86
D16
  Top 0.61: JP1.2 26.06,29.6 26.06,27.97 23.75,25.65 17.02,25.65 16.51,25.15 16.51,22.23 16.54,22.26 JP5.3
  Bottom 0.305: -10.03,5.24 -10.11,5.17 | SV3.6 -10.03,5.24 | -10.03,5.24 -9.43,5.84
  Bottom 0.406: JP5.3 16.54,20.59 13.69,17.74 8.3,17.74 -3.6,5.84 -9.43,5.84
D17
  Top 0.61: JP1.3 28.6,29.89 28.6,28.73 24.38,24.51 19.18,24.51 19.05,24.38 19.05,22.7 19.21,22.54 JP5.4
  Bottom 0.305: -9.66,2.92 -9.4,2.73 SV3.8
  Bottom 0.406: JP5.4 19.31,18.87 17.26,16.82 8.77,16.82 8.75,16.84 -5.17,2.92 -9.66,2.92
D18
  Bottom 0.305: 8.04,1.38 8.08,1.35 | SV4.7 8.04,1.38 | 2.69,9.43 2.91,6.51 8.04,1.38
  Bottom 0.406: JP5.5 21.62,19.39 17.51,15.27 8.75,15.49 2.69,9.43
D19
  Bottom 0.305: SV4.5 8.04,4.08
  Bottom 0.406: JP5.6 24.16,20.13 18.18,14.15 8.75,14.15 3.81,9.21 4.04,8.08 8.04,4.08
D22
  Bottom 0.305: 10.59,9.17 10.55,9.21 | SV4.2 10.59,9.17 | 10.59,9.17 11,8.76
  Bottom 0.406: 11,8.76 17.73,8.76 26.3,17.33 26.38,17.33 28.89,19.84 37.47,19.84 37.62,20 37.66,19.97 JP9.16
D24
  Bottom 0.406: JP9.15 27.8,17.33 16.99,6.51 10.48,6.51 10.47,6.51 | 10.47,6.51 10.32,6.35 | SV4.4 10.47,6.51
D26
  Bottom 0.305: 10.59,4.23 10.55,4.27 | SV4.6 10.59,4.23 | 10.59,4.23 11.22,3.59
  Bottom 0.406: 11.22,3.59 15.71,3.59 26.49,14.82 37.52,14.82 37.62,14.92 37.66,14.89 JP9.14
D28
  Bottom 0.305: SV4.8 16.24,1.43 20.65,5.84 20.65,7.19
  Bottom 0.406: 20.65,7.19 27.16,13.7 34.72,13.7 36.2,12.22 37.62,12.22 37.65,12.25 JP9.13
D30
  Bottom 0.305: SV5.1 25.82,9.21
  Bottom 0.406: 25.82,9.21 25.81,9.22 25.81,10.11 28.28,12.57 33.62,12.57 36.51,9.68 37.69,9.68 | 37.69,9.68 JP9.12 | 37.69,9.68 37.72,9.65
D31
  Bottom 0.406: JP8.12 41.77,9.71 42.86,10.79 42.86,15.56 45.4,18.1 52.23,18.1 52.39,17.94 SV7.1
D32
  Bottom 0.406: 28.34,9.43 28.28,9.43 | SV5.2 28.34,9.43 | 28.34,9.43 34.7,9.43 36.99,7.14 37.62,7.14 37.65,7.17 JP9.11
D33
  Bottom 0.406: SV7.2 54.86,18.03 53.66,16.83 45.88,16.83 43.97,14.92 43.97,9.68 41.43,7.14 40.32,7.14 40.34,7.17 JP8.11
D34
  Bottom 0.254: 30.08,8.08 29.95,8.21 27.13,8.21 25.92,7 25.79,7 25.79,6.94 SV5.3
  Bottom 0.305: SV5.3 25.82,6.97
  Bottom 0.406: 30.08,8.08 33.51,8.08 36.99,4.6 37.62,4.6 37.65,4.63 JP9.10
D35
  Bottom 0.406: SV7.3 46.29,15.49 45.09,14.29 45.09,8.26 41.59,4.76 40.64,4.76 40.36,4.48 | 40.36,4.48 40.32,4.45 | JP8.10 40.36,4.48
D36
  Bottom 0.406: SV5.4 28.37,6.92 28.37,6.96 32.09,6.96 36.99,2.06 37.62,2.06 37.65,2.09 JP9.9
D37
  Bottom 0.406: SV7.4 54.7,15.49 53.5,14.29 46.99,14.29 46.35,13.65 46.35,7.46 40.96,2.06 40.32,2.06 40.34,2.09 JP8.9
D38
  Bottom 0.254: 30,5.53 29.91,5.62 26.6,5.62 25.89,4.91 25.89,4.35 25.84,4.35 SV5.5
  Bottom 0.305: SV5.5 25.92,4.37
  Bottom 0.406: 30,5.53 31.62,5.53 37.62,-0.48 37.65,-0.45 JP9.8
D39
  Bottom 0.406: SV7.5 48.51,12.95 47.47,11.91 47.47,6.03 40.96,-0.48 40.48,-0.48 40.36,-0.6 | 40.36,-0.6 40.32,-0.64 | JP8.8 40.36,-0.6
D40
  Bottom 0.406: JP9.7 37.49,-2.99 37.47,-3.02 30.08,4.37 SV5.6
D41
  Bottom 0.406: SV7.6 55.03,12.8 53.98,11.75 49.53,11.75 48.58,10.79 48.58,3.81 41.75,-3.02 40.32,-3.02 | 40.32,-3.02 40.35,-2.99 JP8.7 | 40.32,-3.02 40.16,-3.17
D42
  Bottom 0.254: SV5.7 25.82,2.01 26.99,3.17 29.69,3.17 30.16,2.7
  Bottom 0.305: SV5.7 25.82,2.03
  Bottom 0.406: JP9.6 37.65,-5.53 37.62,-5.56 30.16,1.91 30.16,2.7
D43
  Bottom 0.406: SV7.7 50.42,10.41 49.85,9.84 49.85,2.86 41.43,-5.56 40.64,-5.56 40.48,-5.4 JP8.6
D44
  Bottom 0.406: SV5.8 28.49,1.83 33.66,-3.33 33.66,-4.13 37.62,-8.1 37.65,-8.07 JP9.5
D45
  Bottom 0.406: JP8.5 41.3,-8.07 50.8,1.43 50.8,8.1 51.59,9.21 53.82,9.21 55.03,10.42 | 55.03,10.42 55.09,10.48 | 55.03,10.42 SV7.8
D46
  Bottom 0.254: JP9.4 38.91,-9.34 42.4,-9.34 43.5,-8.26 44.61,-8.26 44.63,-8.28 44.7,-8.28
  Bottom 0.305: 44.7,-8.28 SV6.1
D47
  Bottom 0.406: JP8.4 43.2,-10.61 44.29,-9.53 53.82,-9.53 55.06,-8.28 | 55.06,-8.28 55.09,-8.26 | 55.06,-8.28 SV6.2
D48
  Bottom 0.254: JP9.3 37.81,-13.15 39.06,-11.87 44.14,-11.87 45.27,-10.77 45.34,-10.77
  Bottom 0.305: SV6.3 52.5,-10.81 52.53,-10.77 45.34,-10.77
D49
  Bottom 0.254: 45.57,-11.9 44.31,-13.15 JP8.3
  Bottom 0.305: SV6.4 55.04,-10.59 55.22,-10.77 53.88,-12.12 45.57,-11.9
D50
  Bottom 0.254: JP9.2 38.92,-14.41 44.8,-14.41 46.02,-13.2 | 46.02,-13.2 46.04,-13.18 | 46.02,-13.2 46.02,-13.24
  Bottom 0.305: SV6.5 52.42,-13.36 52.3,-13.24 46.02,-13.24
D51
  Bottom 0.254: 46.51,-14.59 46.51,-14.61 45.42,-15.69 JP8.2
  Bottom 0.305: SV6.6 55.04,-13.28 55,-13.24 53.65,-14.59 46.51,-14.59 46.47,-14.59
D52
  Bottom 0.254: JP9.1 37.81,-18.23 39.05,-16.97 45.88,-16.94 46.99,-15.88 52.39,-15.88 52.5,-15.98 | 52.5,-15.98 52.55,-16.03 | 52.5,-15.98 SV6.7
D53
  Bottom 0.254: 47.37,-17.29 47.33,-17.29 46.38,-18.23 JP8.1
  Bottom 0.305: 55.22,-15.71 SV6.8 53.65,-17.29 47.37,-17.29
GND  (via drill 0.6, 0.8, 0.9 pad 1.27, 1.3 pad 1.93, 1.4)
  Top 0.305: -13.14,-25.69 -10.12,-22.68 -10.12,-21.29 -10.12,-16.62 -12.73,-14.01
  Top 0.406: 7.85,-6.06 7.91,-6.06 SV4.13 | K13.4 -35.18,-41.01 -35.18,-40.88 -30.86,-40.88 JP10.4 | X10.A3 -12.82,-14.17 -12.82,-14.01 -12.73,-14.01 | -29.86,22.35 -29.86,22.23 | -29.86,22.35 JP3.7 | -29.86,22.68 -29.86,22.35 | C19.1 | C19.1 | C19.1 R22.1 -12.38,-33.81 -12.06,-33.5 -12.06,-32.86 -11.27,-32.07 -10.32,-32.07 -9.68,-31.43 -9.68,-30.96 | -9.68,-30.96 | -9.68,-30.96 U$2.2 -9.75,-30.77 -9.78,-30.73 -9.78,-29.08 | U$1.1 1.97,-30.29 0,-28.32 -9.02,-28.32 -9.78,-29.08 | JP10.5 -13.3,-26.2 -11.05,-28.45 -10.41,-28.45 -9.78,-29.08 | 15.24,30.99 | JP2.1 15.24,30.99 | R19.2 15.21,30.96 15.24,30.99 | -10.12,-21.29
  Top 0.61: v-22.78,-10.73 -22.55,-11.75 -12.54,-11.75 | -12.54,-11.75 -12.39,-11.75 -12.37,-11.72 -12.34,-11.72 -12.34,-4.96 SV3.13 | -13.14,-25.69 JP10.5 | -12.54,-11.75 | -12.54,-11.75 -12.54,-14 | 7.46,-6.78 SV4.13 7.46,-6.78 | 7.46,-6.78 7.46,-12.24 5.88,-13.82 5.88,-14.01 X11.A3 | 7.46,-6.78 7.46,-7.97 7.47,-7.96 24.4,-7.96 | 25.94,-5.67 25.94,-5.65 | 25.94,-5.67 SV5.13 | 24.4,-7.96 25.94,-6.42 25.94,-5.67 | X15.A2 26,-14.19 26,-9.55 24.4,-7.96 | K3.4 65.81,5.64 63.34,3.17 63.34,-11.91 67.64,-16.2 K2.4 | 48.94,-29.63 48.94,-29.64 48.9,-29.69 52.32,-33.11 LSP3.MP | K12.4 -64.78,-29.83 -68.74,-25.88 v-68.74,-22.86 | -59.05,0.25 -58.98,0.25
  Top 0.813: SV6.13 52.64,-23.66 | 48.94,-29.63 44.45,-29.63 K1.4 | SV7.13 49.5,-0.2 49.5,-22.11 50.96,-23.57 52.53,-23.57 | K9.4 -40.67,32.13 -39.29,30.76 -37.95,30.76 -29.86,22.68 | K15.4 5.16,-67.06 5.16,-72.06 | 5.16,-72.06 10.32,-77.23 18.85,-77.23 26.49,-69.59 26.49,-60.61 26.42,-60.61 K16.4 | LSP2.MP -12.58,-68.22 -12.58,-72.29 -14.37,-74.08 -14.37,-76.33 -11.01,-79.7 -2.48,-79.7 5.16,-72.06 | v77.48,18.69 77.4,18.69 68.69,27.39 61.96,27.39 61.28,28.07 61.14,27.92 K4.4
  Top 1.016: LSP7.MP -58.98,0.25 -58.96,2.06 v-63.09,6.06 | K4.4 43.25,45.8 v38.16,45.8 | K7.4 -3.6,66.83 -3.6,63.54 | -3.6,63.54 -3.6,61.07 -0.23,57.7 -0.23,57.25 LSP5.MP 3.59,57.48 13.91,47.15 17.06,47.15 OK1.4 | -3.6,63.54 | -3.6,63.54 v12.34,63.54 | v-41.4,0.25 -59.05,0.25 | LSP1.MP -20.79,-3.9 -22.61,-5.71 -22.61,-10.67 -22.73,-10.79 -22.78,-10.75 v-22.78,-10.73
  Top 1.27: v-29,36.47 -36.33,36.47 -38.89,33.91 -40.67,32.13 | K8.4 -28.1,57.34 -25.14,54.38 -21.97,54.38 -22.01,54.34 LSP6.MP
  Top 1.422: -40.67,32.13 | -38.89,33.91
  Bottom 0.305: 7.92,-15.75 7.92,-22.18
  Bottom 0.406: SV2.13 -31.1,-4.82 | 6.33,-14.17 7.92,-15.75 | JP10.5 -13.33,-25.83 -13.33,-25.72 -15.7,-25.72 JP10.4 | R70.1 34.21,-18.33 36.67,-20.8 37.31,-20.8 37.47,-20.64 37.49,-20.66 JP11.1 37.44,-20.77 | 37.44,-20.77 JP11.2 | 37.44,-20.77 37.31,-20.64 | 23.57,32.38 23.57,32.43 22.73,33.27 17.53,33.27 15.24,30.99 | 23.57,32.38 JP1.1 | 15.24,30.99 | 15.24,30.99 JP2.1 | 23.57,32.38 23.62,32.38 25.11,33.87 25.11,35.11
  Bottom 0.61: -36.05,-13.1 -35.99,-13.1 S1.1 -35.85,-13.06 -29.53,-13.06 S1.2 -29.31,-13.02 -27.53,-13.02 LED33.C -26.86,-13.48 -26.86,-11.87 -26.13,-11.14 -25.52,-10.62 -23.71,-10.65 v-22.78,-10.73 | -31.18,-4.63 -31.18,-4.7 SV2.13 | 7.92,-22.18 R71.1 | X11.A3 5.69,-14.2 5.69,-14.17 6.33,-14.17 | 25.98,-14.21 25.98,-14.17 | X15.A2 25.98,-14.21 | R70.1 25.98,-15.55 25.98,-14.21 | JP11.2 48.24,-20.77 51.12,-23.65 52.55,-23.65 52.68,-23.52 | 52.68,-23.52 52.7,-23.5 | 52.68,-23.52 SV6.13 | SV7.13 52.49,1.64 56.52,-2.38 56.52,-5.08 67.64,-16.2 K2.4 | OK1.4 18.55,47.01 19.84,45.72 19.84,41.91 23.81,37.94 23.81,37.47 25.11,36.17 | 25.11,36.17 C99.- | 25.11,36.17 25.11,35.11 | v-68.74,-22.86 -68.74,-20 -66.2,-17.46 -66.04,-17.46 -59.05,-10.48 -59.05,-8.26 -59.05,-8.1 LSP7.MP | -29.84,22.35 -29.81,22.39 JP3.7
  Bottom 0.813: v-63.09,6.06 -63.32,6.29 -63.32,16.62 -66.68,19.98 -66.66,19.98 K10.4 | K3.4 71.43,5.64 75.46,1.62 75.68,1.62 80.56,6.5 80.56,15.61 v77.48,18.69
  Bottom 1.016: C99.- 25.6,35.81 28.06,35.81 | 28.06,35.81 34.01,35.81 35.8,37.61 35.8,37.58 K5.4 | -36.05,-11.3 -36.05,-13.1 | -36.05,-11.3 -31.18,-6.43 -31.18,-4.7 | v38.16,45.8 33.67,45.8 28.06,40.19 28.06,35.81 | K7.4 -16.66,54.33 LSP6.MP | K6.4 20.11,63.54 v12.34,63.54 | -36.05,-11.3 -36.05,-2.3 -38.61,0.25 | -38.61,0.25 -38.61,11.94 -29.84,20.7 -29.84,22.35 | -38.61,0.25 v-41.4,0.25 | LSP7.MP -59.05,-8.26 -61.77,-5.54 K11.4
  Bottom 1.27: v-29,36.47 -23.12,42.35 -23.12,53.34 -22.03,54.44 -22.01,54.42 LSP6.MP
  pour Bottom (isolate 1.676, hatched): -47.38,46.03 -49.4,14.82 arc-90 44,16.62 60.84,31.66 arc-90 50.96,-50.06 arc-90 -50.07,-50.06 -52.31,-47.82 arc-90 -52.99,43.56 -48.5,46.7 arc-90
  pour Top (isolate 1.422, hatched): -47.6,46.25 -49.4,14.82 arc-90 43.77,16.39 61.06,31.88 arc-90 49.84,-50.29 arc-90 -51.19,-50.29 -53.44,-48.04 arc-90 -53.44,42.66 -49.62,46.48 arc-90
INPUT1
  Bottom 0.61: 37.96,-39.73 37.97,-39.75 | R119.1 37.96,-39.73 | 32.32,-38.84 37.06,-38.84 37.96,-39.73
  Bottom 0.813: SV1.2 -52.54,5.98 -52.54,-0.22 -45.24,-7.07 -45.24,-15.6 -36.6,-24.24 -36.6,-32.55 -9.1,-60.05 9.98,-60.05 31.2,-38.84 32.32,-38.84 | R119.1 37.9,-39.73
INPUT2
  Bottom 0.61: 67.18,-24.13 67.19,-24.14 67.23,-24.14 | 66.34,-24.13 67.18,-24.13 | R112.1 68.42,-22.9 67.18,-24.13
  Bottom 0.813: SV1.1 -43.67,1.64 -43.67,-14.93 -35.25,-23.35 | -8.54,-57.92 9.42,-57.92 30.53,-36.82 33.67,-36.82 37.04,-33.45 37.04,-30.31 39.28,-28.06 55.22,-28.06 60.39,-22.9 65.1,-22.9 66.34,-24.13 | -8.54,-57.92 -8.76,-57.92 | 67.23,-24.14 67.23,-24.13 | -35.25,-23.35 | -35.25,-23.35 -25.37,-33.23 -25.37,-41.08 -8.54,-57.92
INPUT3
  Bottom 0.305: SV1.4 -50.23,8.2 -44.79,8.2
  Bottom 0.406: -44.79,8.2 -39.29,13.7 -39.29,19.31 -32.78,25.82 39.45,25.82 42.37,22.9
  Bottom 0.61: 42.46,22.9 42.37,22.9 43.55,22.9 43.66,23.01 59.15,23.01 62.97,19.2 62.97,16.28 64.65,14.6 64.65,1.13 66.17,-0.38 69.98,-0.38 70.01,-0.35 70.01,-0.32
  Bottom 0.813: R113.1 69.95,1.49 70.01,1.43 70.01,-0.32
INPUT4
  Bottom 0.406: -48.92,9.43 -46.03,9.43 -40.64,14.82 -40.64,19.31 -33.79,26.16 -33.81,26.17 | 45.54,24.7 43.3,26.94 -32.78,26.94 -32.8,26.92 -33.04,26.92 -33.79,26.17 -33.81,26.17 | -33.81,26.17 -33.82,26.17
  Bottom 0.61: 45.54,24.7 60.27,24.7 61.47,23.5 63.12,23.5 64.9,25.27 64.88,25.29 R114.1
  Bottom 0.813: -48.92,9.43 SV1.3 | 64.77,25.08 64.86,25.18 R114.1
INPUT5
  Bottom 0.305: SV1.6 -50.27,10.78 -46.7,10.78
  Bottom 0.406: -41.76,15.72 | -41.76,15.72 -46.7,10.78 | -41.76,15.72 -41.76,19.76 -33.23,28.29 37.94,28.29 40.13,30.48 40.13,36.58 40.16,36.54 R115.1
INPUT6  (via drill 0.8)
  Top 0.61: v26.94,60.84 26.71,60.4 26.49,60.62 4.04,60.62 v3.92,60.73
  Bottom 0.406: -48.97,12.01 -47.26,12.01 -43.11,16.17 -43.11,20.21 -34.13,29.19 -30.81,29.19 -16.66,43.33 -16.66,48.74 -4.72,60.84
  Bottom 0.61: -48.97,12.01 SV1.5 | v3.92,60.73 3.81,60.84 -4.72,60.84
  Bottom 0.813: R116.1 26.19,64.93 26.94,64.19 v26.94,60.84
INPUT7
  Bottom 0.305: SV1.8 -50.31,13.36 -47.71,13.36
  Bottom 0.406: -2.48,64.77 -2.48,64.89 -17.78,49.42 -17.78,44.01 -31.48,30.31 -34.58,30.31 -44.12,20.77 -44.34,16.5 -47.47,13.38 -47.71,13.38 -47.71,13.36 | -2.48,64.77
  Bottom 0.61: -2.81,64.77 -2.48,64.77 0.89,64.77 1.65,65.53 1.65,68.07 0.14,69.58 | 0.14,69.58 0.13,69.6 | 0.14,69.58 R117.1
INPUT8
  Bottom 0.61: -49.17,14.6 SV1.7 -48.72,14.6 -46.48,16.84 -46.72,23.36 -27.86,42.22 -27.62,55.9 -27.62,55.95 -23.24,60.33 -23.24,61.72 -24.66,63.14 R118.1
INPUT9
  Bottom 0.813: SV8.2 -57.25,1.51 -57.25,26.27 -57.17,26.27 -43.94,39.5 -42.55,39.5 -41.77,38.72 R91.1 -41.77,38.59 -41.75,38.58
INPUT10
  Bottom 0.61: SV8.1 -59.05,0.76 -59.05,24.02 -61.97,26.94 -64.21,26.94 -64.24,26.94 -64.26,26.92 -65.15,26.92 -67.46,24.61 R101.1
INPUT11  (1 unrouted)
  Bottom 0.305: -52.76,-7.86 -52.54,-8.08 -49.84,-8.08 -48.95,-8.98 SV8.4 -48.95,-9.43
  Bottom 0.61: -52.76,-7.86 -62.42,1.8 | R111.1 -71.62,-1.07 | -71.4,-0.75 -71.4,0.61 -70.23,1.78 -62.36,1.78 -62.38,1.76
  Bottom 0.813: R111.1 -71.85,-1.2 -71.4,-0.75
INPUT12
  Bottom 0.61: R121.1 -65.9,-27.06 -67.13,-25.83 -67.13,-24.94
  Bottom 0.813: SV8.3 -51.57,-9.43 -52.54,-9.43 -67.13,-24.02 -67.13,-24.94
  Bottom 1.016: R121.1 -65.86,-27.09
INPUT13  (via drill 0.8)
  Top 0.813: SV8.6 -48.93,-11.9 -45.58,-15.23 -39.29,-21.52 v-39.29,-37.04
  Bottom 0.813: v-39.29,-37.04 -39.32,-37.04 -39.37,-36.99 -39.74,-37.36 R131.1
INPUT14  (via drill 0.8)
  Top 0.813: v-62.19,-23.57 -54.34,-31.43 -54.34,-35.92 -35.93,-54.33 v-33.68,-54.33
  Bottom 0.813: SV8.5 -62.19,-22.59 v-62.19,-23.57 | v-33.68,-54.33 -30.99,-54.33 -26.27,-59.04 -26.27,-62.63 -26.95,-64.23 -26.26,-64.55 -25.52,-64.81 -25.45,-64.81 R141.1
INPUT15  (via drill 0.8)
  Top 0.813: v-5.17,-63.98 -5.17,-62.19 -9.66,-57.7 -11.01,-57.7 v-12.46,-59.16
  Bottom 0.813: v-5.17,-63.98 -2.7,-66.45 -2.7,-69.26 0.68,-69.26 0.79,-69.37 0.8,-69.37 151.1 | SV8.8 -38.71,-24.66 -38.71,-32.47 -12.54,-58.64 -12.54,-59.14 -12.48,-59.14 v-12.46,-59.16
  Bottom 1.016: 1.12,-69.37 | 151.1 1.12,-69.37 | 1.12,-69.37 1.08,-69.33
INPUT16
  Bottom 0.813: SV8.7 -58.6,-21.53 -58.6,-24.02 -55.23,-27.39 -45.92,-27.27 -27.62,-45.57 | -27.62,-45.8 -27.84,-54.78 -20.43,-62.19 18.63,-62.19 19.75,-63.31 19.75,-65.11 20.43,-65.78 | -27.62,-45.8 -27.62,-45.57 | 20.43,-65.78 20.43,-65.93 | -27.62,-45.8 -27.62,-45.57 | -27.62,-45.8 | R161.1 22.84,-64.71 22.08,-65.47 22.08,-65.42 22.07,-65.41 21.69,-65.78 20.43,-65.78
LAMP1
  Bottom 1.676: F1.1 57.69,-48.72 53.2,-48.72 L1.2
LAMP2
  Bottom 1.676: F2.1 90.47,-22.8 90.47,-22.67 84.33,-22.67 L2.2
LAMP3
  Bottom 1.676: 83.8,-10.1 83.74,-10.1 | L3.2 83.8,-10.1 | F3.1 88.41,-10.1 83.8,-10.1
LAMP4
  Bottom 1.676: 81.57,18.26 81.49,18.19 | L4.2 81.57,18.26 | F4.1 82.79,19.48 81.57,18.26
LAMP5
  Bottom 1.676: 47.47,57.36 47.59,57.48 | 47.47,57.36 F5.1 | L5.2 45.15,55.04 47.47,57.36
LAMP6
  Bottom 1.676: F6.1 23.6,88.26 23.57,88.23 23.57,80.89 25.19,79.26 25.11,79.17 L6.2
LAMP7
  Bottom 1.676: -9.66,90.37 -9.66,90.48 | -9.66,90.37 F7.1 | -5.39,82.17 -9.66,86.44 -9.66,90.37
  Bottom 1.778: L7.2 -5.39,82.17
LAMP8
  Bottom 1.676: -35.54,73.26 -35.48,73.19 | -35.54,73.26 L8.2 | F8.1 -40.79,78.51 -35.54,73.26
  Bottom 1.778: L8.2 -35.7,73.42
LAMP9
  Bottom 1.676: F9.1 -53.56,45.48 L9.2
LAMP10
  Bottom 1.676: -81.5,24.47 -81.49,24.46 L10.2 -81.55,24.25 -88.46,24.25 -90.03,22.68
  Bottom 1.778: -90.03,22.68 F10.1
LAMP11
  Bottom 1.676: L11.2 -85.17,-7.33 -85.09,-7.41 -87.07,-9.38 F11.1
  Bottom 1.778: L11.2 -85.09,-7.41
LAMP12
  Bottom 1.676: L12.2 -76.17,-37.44 -76.11,-37.49 -80.62,-42 F12.1
LAMP13
  Bottom 1.676: L13.2 -56.58,-39.96 -62.07,-45.45 F13.1
LAMP14
  Bottom 1.676: L14.2 -40.13,-73.86 -40.19,-73.86 -40.19,-78.16 F14.1
LAMP15
  Bottom 1.676: F15.1 -12.8,-90.51 -12.8,-84.19 -11.23,-82.62
  Bottom 1.778: L15.2 -11.23,-82.62
LAMP16
  Bottom 1.676: F16.1 19.52,-88.23 19.53,-88.23 19.53,-83.74 16.83,-81.04
  Bottom 1.778: L16.2 16.83,-81.04
N$1
  Bottom 1.676: K2.1 62.16,-30.29 62.18,-30.31 59.49,-33 59.49,-36.59 64.65,-41.76 70.74,-41.76 73.5,-38.99 | L2.1 76.3,-36.2 73.5,-38.99 | R2.2 73.5,-38.99
N$2
  Bottom 1.676: K1.1 29.18,-45.8 29.18,-50.74 35.69,-57.25 L1.1 38.39,-52.31 48.71,-41.98 52.75,-41.98 R1.1
N$3
  Bottom 1.676: C1.2 45.03,-34.44 R1.2
N$4
  Bottom 1.676: R2.1 63.82,-33.61 64.14,-33.61 64.2,-33.67 75.98,-21.9 75.98,-19.21 | 75.98,-19.21 76.1,-19.08 | 75.98,-19.21 C2.2
N$5
  Bottom 1.676: 86.47,37.5 90.27,34.85 99.37,9.66 94.5,7.15 94.39,-6 99.57,-9.56 98.56,-19.91 | 98.56,-19.91 98.33,-24.47 | 98.56,-19.91 98.78,-23.35 95.69,-30.05 90.3,-30.07 86.54,-39.22 90.56,-43.4 84.63,-52.27 79.52,-58.56 X5.B8
  Bottom 1.778: 86.47,37.5 F4.2 | X5.B8 79.69,-58.59
N$6
  Bottom 1.676: 83.65,6.42 83.51,6.29 83.27,6.53 R3.2 | K3.1 67.52,-9.6 67.57,-9.65 83.65,6.42 | 83.65,6.42 L3.1
N$7
  Bottom 1.016: OK1.1 24.52,41.93 24.47,41.98 23.12,41.98 22,43.11 22,48.95 21.32,49.62 15.94,49.62 13.91,51.64 13.91,53.88 15.71,55.68 | 15.71,55.68 | 15.71,55.68 R99.1
  Bottom 1.676: 24.91,41.98 24.86,41.93 OK1.1
N$8
  Bottom 1.676: C3.2 71.67,10.5 R3.1
N$9
  Bottom 1.778: F1.2 43.55,-64.66 X5.B2
N$10
  Bottom 1.676: 72.73,-44.45 72.6,-44.45 58.37,-58.68 58.37,-65.59 65.33,-72.54 | 65.33,-72.54 65.34,-72.56 | 65.33,-72.54 X5.B4
  Bottom 1.778: 81.94,-43.33 F2.2 81.72,-43.55 72.73,-44.45
N$11
  Bottom 1.676: C4.2 69.22,30.46 67.27,32.41 R4.1
N$12
  Bottom 1.676: R4.2 72.37,36.29 75.2,33.45 75.27,33.52 L4.1 75.29,33.54 75.43,33.68 75.65,33.45 75.65,23.57 66.97,14.9 K4.1
N$13
  Bottom 1.676: R5.2 40.35,48.55 52.53,36.37 56.12,36.37 56.57,36.82 56.63,36.76 L5.1 56.83,36.63 56.35,36.15 56.35,32.56 50.52,26.73 K5.1
N$14
  Bottom 1.27: 29.45,45.58 29.46,45.59 | 29.45,45.58 29.41,45.58 | OK1.2 28.33,44.46 29.45,45.58
  Bottom 1.676: R89.1 24.91,52.31 29.41,47.82 29.41,45.58 | OK1.2
N$15
  Bottom 1.676: R5.1 31.58,39.67 33.22,41.31 39.51,41.31 41.3,43.11 C5.2
N$16
  Bottom 1.676: 90.92,10.11 90.92,-7.41 96.31,-11 95.97,-15.6 94.96,-24.02 93.61,-26.96 87.78,-26.71 83.29,-37.94 82.66,-39.62 86.91,-43.93 83.61,-48.35 80.93,-47.93 76.33,-48.04 75.03,-48.04 67.48,-55.59 67.48,-60.44 72.47,-65.44 72.43,-65.47 X5.B6
  Bottom 1.778: 90.92,10.11 F3.2
N$17
  Top 0.61: 35.24,58.76 K6.1 | 31.88,64.21 31.88,64.33
  Top 1.676: R6.2 18.98,67.58 28.51,67.58 31.88,64.21 35.24,60.84 35.24,58.76 | 31.88,64.33 L6.1
N$18
  Bottom 1.676: 24.67,71.83 24.69,71.84 24.43,71.84 C6.2 24.41,71.87 24.46,71.92 22.22,74.16 R6.1
N$19
  Bottom 1.778: F5.2 71.84,51.19 79.47,58.82 X6.B2
N$20
  Bottom 1.676: F8.2 -12.74,96.67 -1.1,96.08 | 20.62,98.01 31.65,93.62 32.1,90.03 40.41,86.66 44.22,88.68 54.1,83.74 56.8,81.05
  Bottom 1.778: -1.1,96.08 14.48,95.9 20.62,98.01 | 56.8,81.05 X6.B8
N$21
  Bottom 1.676: C7.2 -4.15,75.21 -6.32,75.21 R7.1
N$22
  Top 1.676: R7.2 -7.19,67.16 -7.19,70.5 -6.74,70.95 6.28,70.95 | 6.28,70.95 8.08,70.95 11.22,67.8 11.22,66.97 | 11.22,66.97 11.22,66.91 | 11.22,66.97 K7.1 | L7.1 6.06,76.78 6.06,71.62 6.28,71.39 6.28,70.95
N$23
  Top 1.676: R8.2 -30.31,59.25 -30.31,62.19 -27.62,64.89 -23.13,66.46 -22.79,66.79 | -22.79,66.79 -22.23,67.35 -21.11,78.78 L8.1 | -22.79,66.79 -22.68,66.68 -15.56,66.68 K8.1
N$24
  Bottom 1.676: C8.2 -30.99,66.5 -30.99,66.46 -33.66,66.46 R8.1
N$25
  Bottom 1.676: 22,93.85 28.06,91.83 29.41,86.44 40.41,81.72 44.9,84.87 50.78,81.87 49.14,74.73 56.53,67.34 59.81,67.34 61.92,69.44 61.92,69.66 65.1,72.84 65.22,72.84 | 65.22,72.84 65.24,72.84 | 65.22,72.84 X6.B6
  Bottom 1.778: F7.2 17.51,92.05 22,93.85
N$26
  Bottom 1.676: F6.2 44.51,73.76 58.39,59.88 66.32,59.88 72.13,65.68 72.16,65.66 X6.B4
N$27
  Bottom 1.016: R112.2 68.47,-18.63 67.12,-18.63 66.9,-18.41 66.81,-18.5 K2.3
N$28
  Bottom 1.016: K3.3 67.39,3.1 67.35,3.15 67.62,3.42 R113.2
N$29
  Bottom 1.016: K4.3 61.99,25.56 61.96,25.6 63.41,27.04 R114.2
N$30
  Bottom 0.813: K5.3 37.49,35.74 37.49,36.6 38.83,37.94 38.83,37.87 R115.2
N$31
  Bottom 0.813: K6.3 23.34,63.76 23.34,64.55 R116.2
N$32
  Bottom 0.813: K7.3 -1.34,67.34 -1.76,67.76 R117.2
N$33
  Bottom 0.813: R118.2 | R118.2 | K8.3 -25.75,61.67 R118.2
N$34
  Bottom 1.016: R119.2 39.28,-37.94 K1.3
N$36
  Bottom 1.016: R101.2 -67.96,22.61 -66.46,22 -66.01,22 -65.75,22.26 K10.3
N$38
  Bottom 0.305: R111.2 -71.85,-3.14 -69.83,-3.14 K11.3
N$40
  Bottom 1.016: K12.3 -63.22,-27.49 -63.09,-27.61 -63.85,-28.37 R121.2
N$42
  Bottom 0.813: R131.2 -37.05,-39.73 K13.3
N$44
  Bottom 0.813: R141.2 -21.84,-66.28 -22.01,-66 -21.33,-63.98 -21.36,-64.01 K14.3
N$46
  Bottom 1.016: K15.3 2.5,-67.09 2.46,-67.12 2.83,-67.5 151.2
N$48
  Bottom 0.813: K16.3 24.03,-61.75 25.36,-63.08 R161.2
N$50
  Bottom 1.016: R91.2 -41.31,35.47 K9.3
N$59
  Bottom 1.676: R9.1 -44.39,30.09 -42.84,30.31 -31.62,41.53 -31.62,44.52 -31.92,44.82 -31.89,44.85 K9.1 -31.89,45.22 -31.84,45.26 -31.88,45.3 -31.88,49.11 -39.12,56.35 L9.1
N$60
  Bottom 1.676: R9.2 -52.87,38.39 -49.62,38.39 -48.27,39.74 -48.27,39.87 C9.2
N$61
  Bottom 1.676: K10.1 -60.62,34.13 -67.81,41.31 -73.19,41.31 -74.94,39.57 L10.1 -75.22,39.52 -75.22,32.56 -71.4,28.74 -71.4,18.98 R10.2
N$62
  Bottom 1.676: R10.1 -79.56,20.29 -79.48,20.21 -76.56,23.13 -74.3,23.13 C10.2
N$63
  Bottom 1.676: R11.2 -70.11,-9.82 -77.46,-2.47 -77.46,2.02 | L11.1 -77.81,2.02 -77.46,2.02 | K11.1 -69.88,9.88 -70.05,9.88 -70.05,9.43 -77.46,2.02
N$64
  Bottom 1.676: -79.92,-9.86 -79.93,-9.88 | -79.92,-9.86 R11.1 | C11.2 -78.45,-8.4 -79.92,-9.86
N$65
  Bottom 1.676: -69.64,-33.26 -69.6,-33.23 | C12.2 -69.64,-33.26 | R12.1 -71,-34.62 -69.64,-33.26
N$66
  Bottom 1.676: R12.2 -64.31,-34.03 -71.4,-26.94 | -82.48,-22.14 L12.1 -77.45,-27.16 -71.62,-27.16 -71.4,-26.94 | K12.1 -68.1,-16.01 -71.4,-19.3 -71.4,-26.94
N$67
  Bottom 1.676: K13.1 -46.48,-29.86 -50.52,-29.86 -55.01,-34.35 -55.01,-37.49 -44.68,-47.82 L13.1 -43.78,-52.76 R13.2
N$68
  Bottom 1.676: C13.2 -34.27,-46.38 R13.1
N$69
  Bottom 1.676: K14.1 -31.89,-60.42 -31.89,-73.19 -24.93,-80.15 | -24.93,-80.15 -24.91,-80.15 L14.1 | R14.2 -23.34,-80.15 -24.93,-80.15
N$70
  Bottom 1.676: C14.2 -22.22,-72.06 -17.29,-72.06 -16.17,-70.94 -16.01,-70.94 R14.1
  Bottom 1.778: R14.1 -15.95,-70.72
N$71
  Bottom 1.676: 9.42,-70.69 9.42,-70.49 | R15.1 9.42,-70.69 | 4.93,-75.88 9.42,-71.39 9.42,-70.69
  Bottom 1.778: 4.93,-75.88 C15.2
N$72
  Bottom 1.676: 5.16,-82.83 5.16,-82.84 | 5.16,-82.83 L15.1 5.37,-82.62 8.65,-82.62 R15.2 | K15.1 5.16,-82.3 5.16,-82.83
N$73
  Bottom 1.676: K16.1 15.84,-70.04 20.65,-70.04 25.36,-74.76 32.1,-74.76 32.1,-74.71 L16.1 | 31.88,-74.53 31.92,-74.53 L16.1 | R16.2 37.05,-74.31 32.1,-74.31 32.1,-74.55 L16.1
N$74
  Bottom 1.676: 32.32,-62.71 32.32,-62.41 | R16.1 32.32,-62.71 | 29.85,-68.02 32.32,-65.55 32.32,-62.71
  Bottom 1.778: 29.85,-68.02 C16.2
N$75  (via drill 0.7)
  Top 0.406: C17.1 -10.47,-39.94 -9.78,-40.64 -6.22,-40.64 v-5.71,-40.01 -5.4,-39.69 R17.1
  Bottom 0.406: U$1.2 1.27,-35.4 0.16,-35.4 -3.05,-38.61 | -3.05,-38.61 -3.08,-38.64 | -3.05,-38.61 | v-5.71,-40.01 -4.45,-40.01 -3.05,-38.61
N$79
  Top 0.406: U$2.3 -10.63,-30.32 -12.22,-28.73 -15.56,-28.73 -15.88,-29.05 -15.88,-30.8 -15.87,-30.8 | -15.87,-30.8 C19.2 | R22.2 R21.1 | -15.87,-30.8 R22.2 | R22.2 -15.72,-33.97 | R21.1 -16.03,-37.62 | R21.1
N$80
  Top 0.406: -8.41,-39.05 | -8.41,-39.05 C17.2 | R20.2 -8.57,-38.89 -8.41,-39.05
N$81
  Top 0.406: -2.7,-32.7 | R23.2 -2.7,-32.7 | -2.7,-32.7 C18.1 -5.87,-32.07 -9.05,-32.07 -10.35,-33.37 U$2.4 -10.63,-33.34 | -2.7,-32.7 | -10.63,-33.34 -10.64,-33.34 | R20.1 -10.47,-33.5 -10.63,-33.34
N$139
  Bottom 1.676: F12.2 -91.38,-21.28 -91.38,-21.33 -91.38,-19.53 -99.24,-11.67 -99.24,-9.43 -93.85,-4.49 -94.07,6.96 -99.46,11 -99.46,19.98 -99.24,20.21 -94.75,30.98 -90.71,31.88 -87.56,39.07 -90.26,42.66 -85.99,53.21 -85.99,53.84 -82.31,57.51 | -82.3,57.53 -82.31,57.51 | -82.31,57.51 X2.B8
  Bottom 1.778: -91.38,-21.33 F12.2
N$140
  Bottom 1.778: F9.2 -46.93,64.44 -61.3,78.8 X2.B2
N$141
  Bottom 1.676: F10.2 -80.82,42.66 -75.89,42.66 -59.05,59.5 -59.05,62.64 -68.25,71.84 -68.25,71.72 X2.B4
N$142
  Bottom 1.676: -93.4,13.47 -95.42,15.49 -95.42,21.33 -93.4,27.39 -87.79,28.07 -83.3,39.29 -87.34,42.43 -84.19,49.17
  Bottom 1.778: X2.B6 -67.81,57.03 -68.03,55.01 -72.07,50.97 -80.83,48.05 -84.19,49.17 | -93.4,13.47 F11.2
N$143
  Bottom 1.676: F13.2 -56.13,-51.63 -70.72,-51.41 -79.02,-59.71 X3.B2
N$144
  Bottom 1.676: -50.59,-86.44 -46.1,-88.23 -41.87,-89.36 -38.2,-87.26 -31.66,-90.03 -29.31,-95.75 -23.13,-98.11 | -15.27,-98.33 -6.83,-98.13 -3.11,-93.92 5.32,-94.13 13.88,-97.56 13.91,-97.43
  Bottom 1.778: -50.59,-86.44 X3.B8 | -15.27,-98.33 -23.13,-98.11 | 13.91,-97.43 38.61,-86.21 40.41,-79.47 F16.2
N$145
  Bottom 1.676: -47.15,-84.41 -42.78,-85.92 -38.98,-83.39 -28.86,-87.74 -26.27,-93.62 -22.68,-94.96 | -14.82,-95.19 -9.65,-95.02 -5.43,-90.24 9.81,-90.56 F15.2
  Bottom 1.778: X3.B6 -59.05,-68.02 -56.36,-68.02 -46.48,-77.9 -47.15,-84.41 | -14.82,-95.19 -22.68,-94.96 | F15.2 9.42,-90.7
N$146
  Bottom 1.676: X3.B4 -72.09,-66.69 -65.78,-60.39 -56.36,-60.39 -49.4,-67.35 -41.76,-67.35 -35.48,-73.64 -35.48,-76.78 -22.68,-89.58 -22.67,-89.58 F14.2 -22.45,-89.81
  Bottom 1.778: F14.2 -22.23,-89.58
N$163
  Bottom 0.61: R64.1 -25.3,-15.48 -25.29,-15.48 -25.29,-13.76 LED33.A
RES
  Bottom 0.61: JP10.1 -23.41,-25.8 -23.35,-25.8 -23.35,-22.89 | R65.1 -23.35,-19.68 -23.35,-22.89 | -36.01,-17.6 -36.16,-17.6 | -36.01,-17.6 S1.3 | -36.01,-17.6 -29.51,-17.6 S1.4 -24.21,-22.89 -23.35,-22.89
RX0
  Bottom 0.305: SV3.1 -12.38,10.97
  Bottom 0.406: -3.37,19.98 4.85,20.01 6.98,22.14 6.98,22.37 JP4.1
  Bottom 0.61: -12.38,10.97 -3.37,19.98
RX3V3
  Top 0.406: R19.1 12.57,32.89 | R19.1 | R18.2 11.18,32.86 | 11.18,32.86 R19.1 | JP2.2 17.78,29.72 16.89,28.83 11.94,28.83 11.18,29.72 11.18,32.86 | 11.18,32.86 11.05,32.89
SCL
  Bottom 0.406: SV4.1 10.23,11.23 18.4,11.23 29.41,22.23 29.41,22.45 29.29,22.45 JP5.8
SDA
  Bottom 0.305: 26.7,21.32 JP5.7 | 8.08,6.74 8.04,6.71 SV4.3
  Bottom 0.406: 26.7,21.32 17.73,12.35 8.3,12.35 5.61,9.66 5.61,9.21 8.08,6.74
TX1
  Bottom 0.305: SV3.3 -11.12,9.05 -11.12,11.12 -10,12.24 -9.32,12.24
  Bottom 0.406: -9.32,12.24 -2.59,18.97 -2.58,18.96 5.3,18.96 6.95,20.61 8.52,20.61 9.26,21.35 9.26,23.6 8.52,24.34 5.61,24.34 4.51,23.24 4.51,22.44 JP4.2
TX3V3
  Top 0.406: Q1.2 17.78,36.32 17.78,35.56 17.27,35.05 8.76,35.05 7.62,36.2 7.62,38.48 8.19,39.05 R24.2 | Q1.2 17.7,36.24 17.65,36.2 17.78,36.07 | Q1.2 17.44,36.24 17.53,36.32 19.18,36.32 19.43,36.07 19.43,31.88 20.32,30.99 JP2.3
VCC  (via drill 0.6, 0.8)  (1 unrouted)
  Top 0.406: U$2.5 -8.73,-33.34 -5.87,-36.2 R17.2 -5.24,-36.2 -4.6,-36.2 -3.49,-37.31 -3.49,-39.37 -5.56,-41.43 -10.64,-41.43 -13.97,-38.1 R21.2 -14.13,-37.62 -13.97,-37.78 -13.97,-39.69 -14.29,-40.01 v-14.45,-40.01
  Top 0.61: 55.09,-23.5 55.06,-23.52 SV6.14 55.04,-23.61 55.09,-23.65 55.09,-25.4 53.82,-26.67 50.96,-26.67 48.58,-24.29 48.58,-23.65 36.83,-23.65 33.81,-20.64 33.81,-11.15 28.36,-5.7 | SV7.14 55.03,2.8 55.24,3.02 56.36,3.02 58.26,4.92 58.26,19.68 55.54,22.41 JP12.2 40.36,22.44 40.33,22.41 JP12.1 37.47,22.5 37.45,22.52 37.49,22.56 37.49,31.13 28.84,39.37 20.07,39.37 v20.1,39.34 | 14.92,39.21 | 14.92,39.21 R25.1 | 28.36,-5.7 28.31,-5.65 | SV5.14 28.36,-5.7 | 14.92,39.21 14.92,39.31 15.62,40.01 19.56,40.01 20.19,39.37 20.16,39.34 v20.1,39.34 | v20.1,39.34
  Top 0.813: SV7.14 57.92,-0.09 57.92,-20.65 55.11,-23.46 55.1,-23.46 SV6.14
  Bottom 0.305: 14.55,-8.72 14.55,-20.61
  Bottom 0.406: 14.55,-20.61 14.5,-20.67 14.5,-21.35 13.43,-22.42 12.45,-22.42 12.45,-22.47 R66.1 | JP10.3 -18.38,-38.77 -17.14,-40.01 v-14.45,-40.01 | v20.1,39.34 20.16,39.34 20.19,39.37 20.24,39.32 C99.+
  Bottom 0.61: 26.89,-8.62 26.99,-8.52 27.45,-8.52 28.36,-7.62 SV5.14 | -20.79,-8.84 -20.8,-8.85 -20.8,-23.44 JP10.3 | 14.55,-8.72 14.55,-8.65 12.1,-6.19 SV4.14 10.51,-6.12 | 10.51,-6.12 10.51,-6.03 | 10.51,-6.12 10.51,-7.46 9.95,-8.01 -7.12,-8.01 -8.09,-7.04 -9.88,-7.04 -9.96,-7.04 | C99.+ 20.24,35 | R55.2 12.92,42 14.92,40.01 19.56,40.01 20.1,39.47 v20.1,39.34 | SV5.14 28.38,-5.77 | SV5.14 | v20.1,39.34 20.07,39.37 | v20.1,39.34 | v20.1,39.34 20.24,39.19
  Bottom 0.813: SV2.14 -28.56,-5.57 -25.37,-8.75 -20.79,-8.84 -13.48,-8.98 -11.68,-8.98 -9.88,-7.18 -9.88,-7.04 -9.88,-4.94 -9.86,-4.92 SV3.14 | 14.55,-8.72 26.89,-8.62 | SV6.14 55.04,-23.53 | 10.32,-8.53
(copper drawn outside any net)
  shapes: Bottom circle x1, Top circle x1

## Text on the board
tNames: L9 | B | L8 | L10 | L7 | L11 | L6 | L12 | L5 | C | GND | TX5V | RX5V | GND | RX3V3 | TX3V3 | ~AC2 | ~AC1 | INPUT1 | OUTPUT5 | OUTPUT1 | OUTPUT2 | OUTPUT3 | OUTPUT4 | INPUT2 | OUTPUT6 | POT1 | POT2 | POT3 | T1 | T2 | S1 | DISKO3200 (rev.b) / 2011 | designed by nakednindza | nakednindza@pravi.me | A | L13 | L4 | L14 | L3 | L15 | L2 | L16 | D | L1